# EAGLE schematic mainboard-01-8x2+1c (EAGLE 9.6.2)

## Sheet 1 of 17
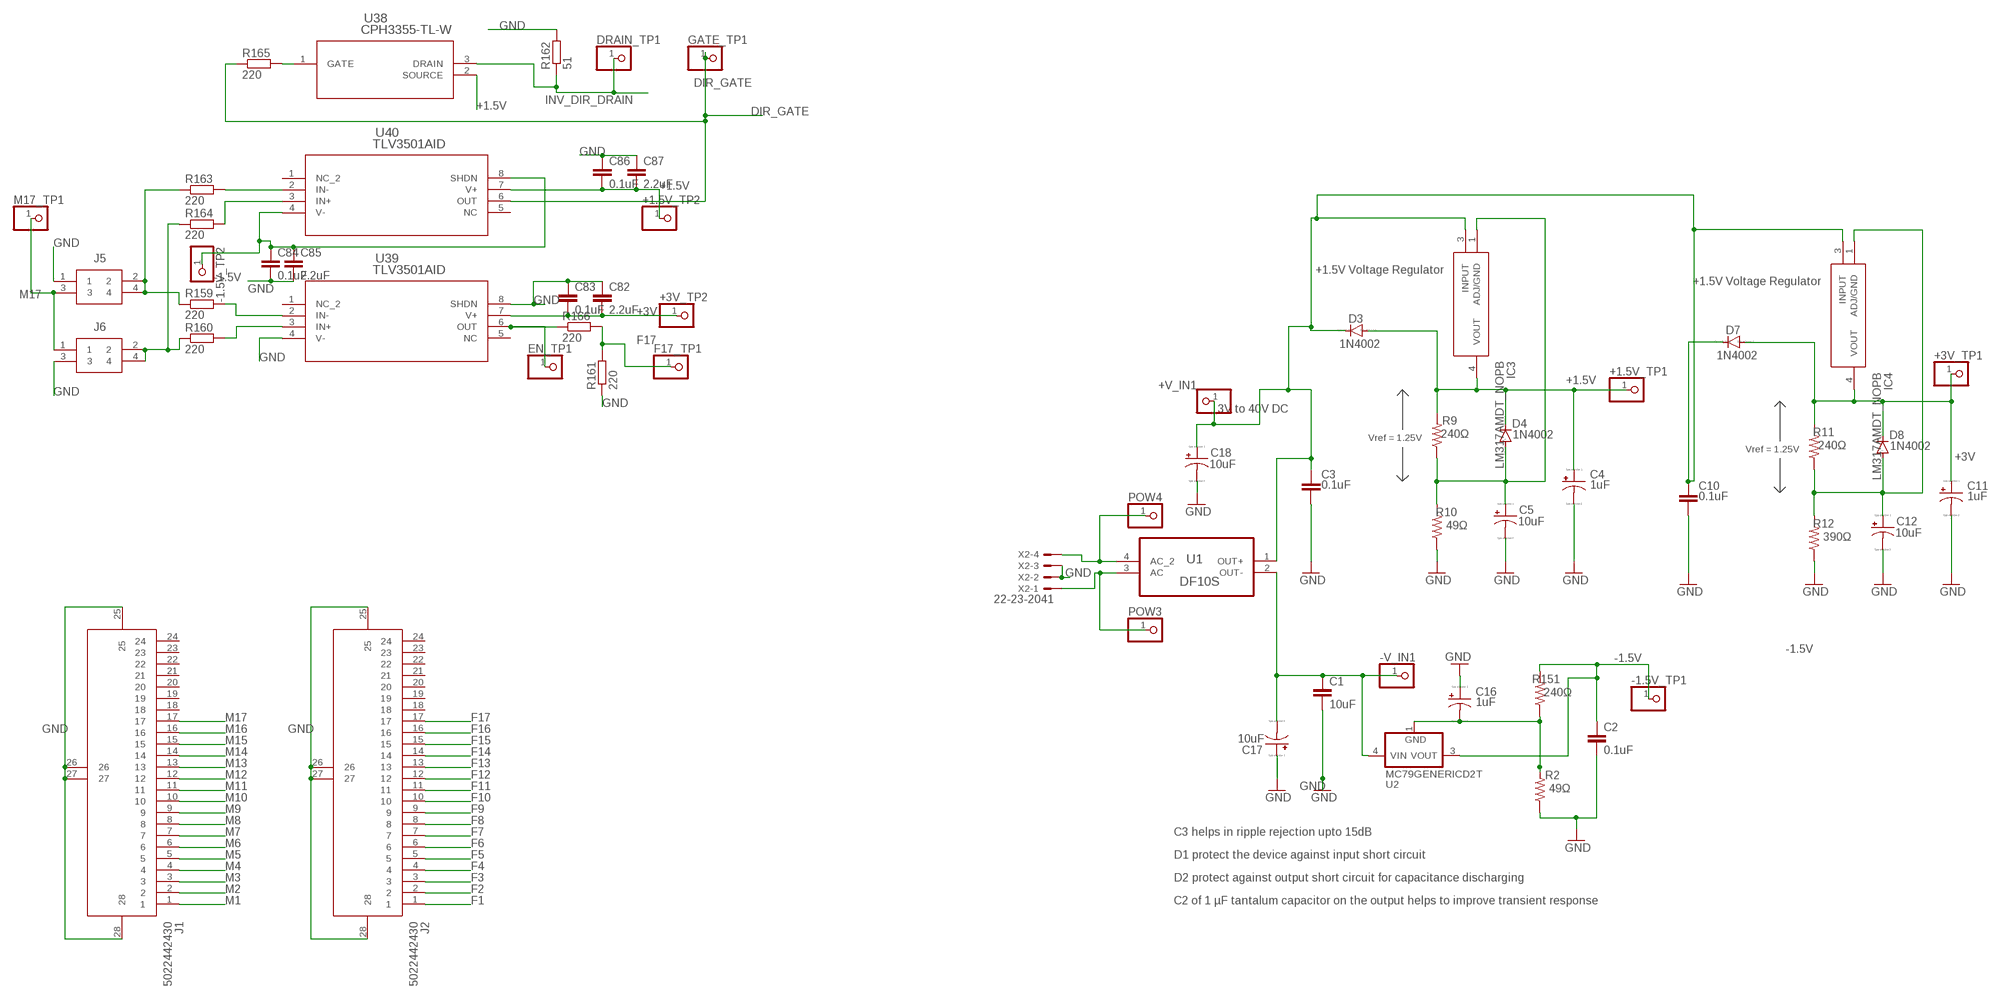
[diagram p0: schematic, sheet 1]

### Parts
+1.5V_TP1  PINHD-1X1  [1X01]
+1.5V_TP2  PINHD-1X1  [1X01]
+3V_TP1  PINHD-1X1  [1X01]
+3V_TP2  PINHD-1X1  [1X01]
+V_IN1  PINHD-1X1  [1X01]
-1.5V_TP1  PINHD-1X1  [1X01]
-1.5V_TP2  PINHD-1X1  [1X01]
-V_IN1  PINHD-1X1  [1X01]
C1  10uF  C-EUC0805  [C0805]
C2  0.1uF  C-EUC0805  [C0805]
C3  0.1uF  C-EU075-052X106  [C075-052X106]
C4  1uF  CPOL-US085CS-1AR  [085CS_1AR]
C5  10uF  CPOL-US085CS-1AR  [085CS_1AR]
C10  0.1uF  C-EU075-052X106  [C075-052X106]
C11  1uF  CPOL-US085CS-1AR  [085CS_1AR]
C12  10uF  CPOL-US085CS-1AR  [085CS_1AR]
C16  1uF  CPOL-US085CS-1AR  [085CS_1AR]
C17  10uF  CPOL-US085CS-1AR  [085CS_1AR]
C18  10uF  CPOL-US085CS-1AR  [085CS_1AR]
C82  2.2uF  C-EUC0805  [C0805]
C83  0.1uF  C-EUC0805  [C0805]
C84  0.1uF  C-EUC0805  [C0805]
C85  2.2uF  C-EUC0805  [C0805]
C86  0.1uF  C-EUC0805  [C0805]
C87  2.2uF  C-EUC0805  [C0805]
D3  1N4002  1N4004  [DO41-10]
D4  1N4002  1N4004  [DO41-10]
D7  1N4002  1N4004  [DO41-10]
D8  1N4002  1N4004  [DO41-10]
DRAIN_TP1  PINHD-1X1  [1X01]
EN_TP1  PINHD-1X1  [1X01]
F17_TP1  PINHD-1X1  [1X01]
GATE_TP1  PINHD-1X1  [1X01]
IC3  LM317AMDT_NOPB  [TO228P991X238-3N]
IC4  LM317AMDT_NOPB  [TO228P991X238-3N]
J1  5022442430  [5022442430]
J2  5022442430  [5022442430]
J5  70287-1098  [HDRV4W64P254_2X2_521X508X851P]
J6  70287-1098  [HDRV4W64P254_2X2_521X508X851P]
M17_TP1  PINHD-1X1  [1X01]
POW3  PINHD-1X1  [1X01]
POW4  PINHD-1X1  [1X01]
R2  49Ω  R-US_M0805  [M0805]
R9  240Ω  R-US_M0805  [M0805]
R10  49Ω  R-US_M0805  [M0805]
R11  240Ω  R-US_M0805  [M0805]
R12  390Ω  R-US_M0805  [M0805]
R151  240Ω  R-US_M0805  [M0805]
R159  220  R-EU_R0603  [R0603]
R160  220  R-EU_R0603  [R0603]
R161  220  R-EU_R0603  [R0603]
R162  51  R-EU_R0805  [R0805]
R163  220  R-EU_R0603  [R0603]
R164  220  R-EU_R0603  [R0603]
R165  220  R-EU_R0603  [R0603]
R166  220  R-EU_R0603  [R0603]
U1  DF10S  [SOT508P985X260-4N]
U2  MC79GENERICD2T  [D2PAK-3]
U38  CPH3355-TL-W  [CPH3_2P9X1P6_ONS]
U39  TLV3501AID  [D8]
U40  TLV3501AID  [D8]
X2  22-23-2041  [22-23-2041]

### Nets
+1.5V: +1.5V_TP1.1 +1.5V_TP2.1 C4.+ C86.2 C87.2 D3.A D4.C IC3.4(VOUT) R9.2 U38.2(SOURCE) U40.7(V+) ; also sheet 2,3,4,5,6,7,8,9,10,11,12,13,14,15,16,17
+3V: +3V_TP1.1 +3V_TP2.1 C11.+ C82.2 C83.2 D7.A D8.C IC4.4(VOUT) R11.2 U39.7(V+) ; also sheet 2,3,4,5,6,7,8,9,10,11,12,13,14,15,16,17
-1.5V: -1.5V_TP1.1 -1.5V_TP2.1 C2.1 C84.1 C85.1 R151.2 U2.3(VOUT) U40.4(V-) U40.8(SHDN) ; also sheet 2,3,4,5,6,7,8,9,10,11,12,13,14,15,16,17
DIR_GATE: GATE_TP1.1 R165.1 U40.6(OUT) ; also sheet 2,3,4,5,6,7,8,9,10,11,12,13,14,15,16,17
F1: J2.1 ; also sheet 17
F2: J2.2 ; also sheet 16
F3: J2.3 ; also sheet 15
F4: J2.4 ; also sheet 14
F5: J2.5 ; also sheet 13
F6: J2.6 ; also sheet 12
F7: J2.7 ; also sheet 11
F8: J2.8 ; also sheet 10
F9: J2.9 ; also sheet 9
F10: J2.10 ; also sheet 8
F11: J2.11 ; also sheet 7
F12: J2.12 ; also sheet 6
F13: J2.13 ; also sheet 5
F14: J2.14 ; also sheet 4
F15: J2.15 ; also sheet 3
F16: J2.16 ; also sheet 2
F17: F17_TP1.1 J2.17 R161.2 R166.2
GND: C1.2 C2.2 C3.2 C4.- C5.- C10.2 C11.- C12.- C16.+ C17.+ C18.- C82.1 C83.1 C84.2 C85.2 C86.1 C87.1 J1.25 J1.26 J1.27 J1.28 J2.25 J2.26 J2.27 J2.28 J5.1 J6.3 R2.1 R10.1 R12.1 R161.1 R162.2 U39.4(V-) U39.8(SHDN) X2.2 X2.3 ; also sheet 2,3,4,5,6,7,8,9,10,11,12,13,14,15,16,17
IN_2: POW3.1 U1.3(AC) X2.1
INPPOS1: +V_IN1.1 C3.1 C10.1 C18.+ D3.C D7.C IC3.3(INPUT) IC4.3(INPUT) U1.1(OUT+)
INV_DIR_DRAIN: DRAIN_TP1.1 R162.1 U38.3(DRAIN) ; also sheet 2,3,4,5,6,7,8,9,10,11,12,13,14,15,16,17
M1: J1.1 ; also sheet 17
M2: J1.2 ; also sheet 16
M3: J1.3 ; also sheet 15
M4: J1.4 ; also sheet 14
M5: J1.5 ; also sheet 13
M6: J1.6 ; also sheet 12
M7: J1.7 ; also sheet 11
M8: J1.8 ; also sheet 10
M9: J1.9 ; also sheet 9
M10: J1.10 ; also sheet 8
M11: J1.11 ; also sheet 7
M12: J1.12 ; also sheet 6
M13: J1.13 ; also sheet 5
M14: J1.14 ; also sheet 4
M15: J1.15 ; also sheet 3
M16: J1.16 ; also sheet 2
M17: J1.17 J5.3 J6.1 M17_TP1.1
N$2: C16.- R2.2 R151.1 U2.1(GND)
N$7: C5.+ D4.A IC3.1(ADJ/GND) R9.1 R10.2
N$8: C12.+ D8.A IC4.1(ADJ/GND) R11.1 R12.2
N$9: POW4.1 U1.4(AC_2) X2.4
N$10: -V_IN1.1 C1.1 C17.- U1.2(OUT-) U2.4(VIN)
N$158: R159.2 U39.2(IN-)
N$159: R160.2 U39.3(IN+)
N$160: EN_TP1.1 R166.1 U39.6(OUT)
N$161: J6.2 J6.4 R160.1 R164.1
N$162: J5.2 J5.4 R159.1 R163.1
N$163: R163.2 U40.2(IN-)
N$164: R164.2 U40.3(IN+)
N$165: R165.2 U38.1(GATE)
Unconnected: J1.18 J1.19 J1.20 J1.21 J1.22 J1.23 J1.24 J2.18 J2.19 J2.20 J2.21 J2.22 J2.23 J2.24 U39.1(NC_2) U39.5(NC) U40.1(NC_2) U40.5(NC)

### Notes on the sheet
- +1.5V Voltage Regulator
- +1.5V Voltage Regulator
- 3V to 40V DC
- Vref = 1.25V
- Vref = 1.25V
- C3 helps in ripple rejection upto 15dB
- D1 protect the device against input short circuit
- D2 protect against output short circuit for capacitance discharging
- C2 of 1 µF tantalum capacitor on the output helps to improve transient response

## Sheet 2 of 17
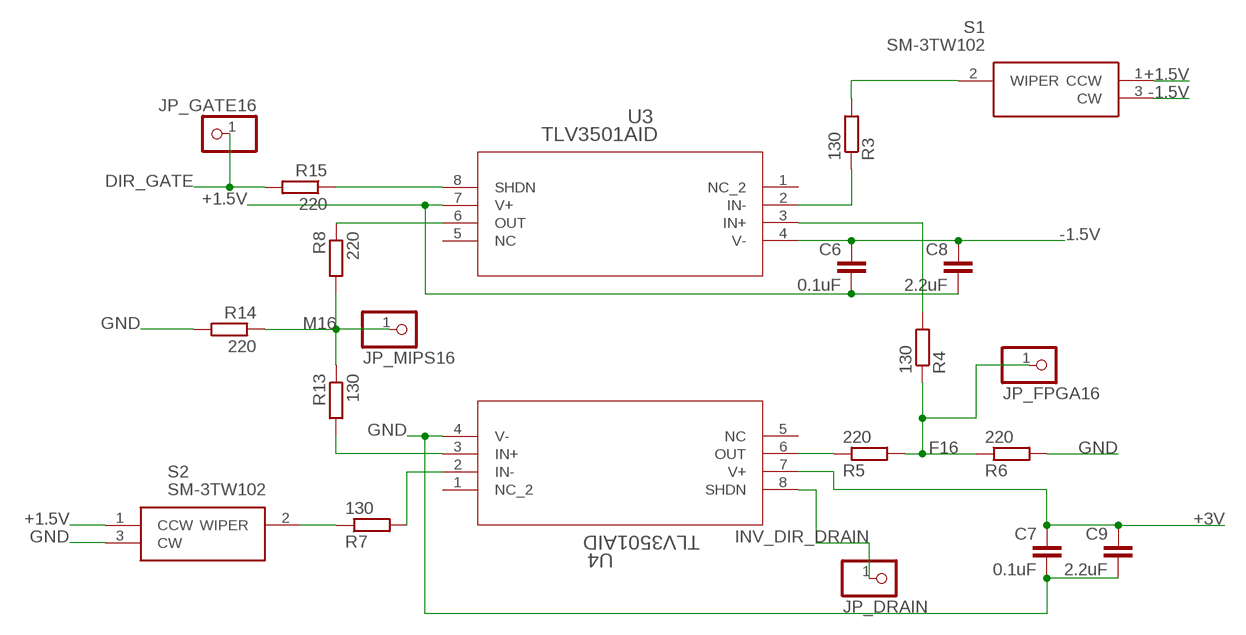
[diagram p1: schematic, sheet 2]

### Parts
C6  0.1uF  C-EUC0805  [C0805]
C7  0.1uF  C-EUC0805  [C0805]
C8  2.2uF  C-EUC0805  [C0805]
C9  2.2uF  C-EUC0805  [C0805]
JP_DRAIN  PINHD-1X1  [1X01]
JP_FPGA16  PINHD-1X1  [1X01]
JP_GATE16  PINHD-1X1  [1X01]
JP_MIPS16  PINHD-1X1  [1X01]
R3  130  R-EU_R0805  [R0805]
R4  130  R-EU_R0603  [R0603]
R5  220  R-EU_R0805  [R0805]
R6  220  R-EU_R0805  [R0805]
R7  130  R-EU_R0805  [R0805]
R8  220  R-EU_R0805  [R0805]
R13  130  R-EU_R0805  [R0805]
R14  220  R-EU_R0805  [R0805]
R15  220  R-EU_R0805  [R0805]
S1  SM-3TW102  [SM3TW102]
S2  SM-3TW102  [SM3TW102]
U3  TLV3501AID  [D8]
U4  TLV3501AID  [D8]

### Nets
+1.5V: C6.2 C8.2 S1.1(CCW) S2.1(CCW) U3.7(V+) ; also sheet 1,3,4,5,6,7,8,9,10,11,12,13,14,15,16,17
+3V: C7.1 C9.1 U4.7(V+) ; also sheet 1,3,4,5,6,7,8,9,10,11,12,13,14,15,16,17
-1.5V: C6.1 C8.1 S1.3(CW) U3.4(V-) ; also sheet 1,3,4,5,6,7,8,9,10,11,12,13,14,15,16,17
DIR_GATE: JP_GATE16.1 R15.2 ; also sheet 1,3,4,5,6,7,8,9,10,11,12,13,14,15,16,17
F16: JP_FPGA16.1 R4.1 R5.2 R6.1 ; also sheet 1
GND: C7.2 C9.2 R6.2 R14.2 S2.3(CW) U4.4(V-) ; also sheet 1,3,4,5,6,7,8,9,10,11,12,13,14,15,16,17
INV_DIR_DRAIN: JP_DRAIN.1 U4.8(SHDN) ; also sheet 1,3,4,5,6,7,8,9,10,11,12,13,14,15,16,17
M16: JP_MIPS16.1 R8.2 R13.1 R14.1 ; also sheet 1
N$1: R3.2 S1.2(WIPER)
N$3: R3.1 U3.2(IN-)
N$4: R4.2 U3.3(IN+)
N$5: R5.1 U4.6(OUT)
N$6: R7.1 S2.2(WIPER)
N$11: R7.2 U4.2(IN-)
N$12: R13.2 U4.3(IN+)
N$13: R8.1 U3.6(OUT)
N$14: R15.1 U3.8(SHDN)
Unconnected: U3.1(NC_2) U3.5(NC) U4.1(NC_2) U4.5(NC)

## Sheet 3 of 17
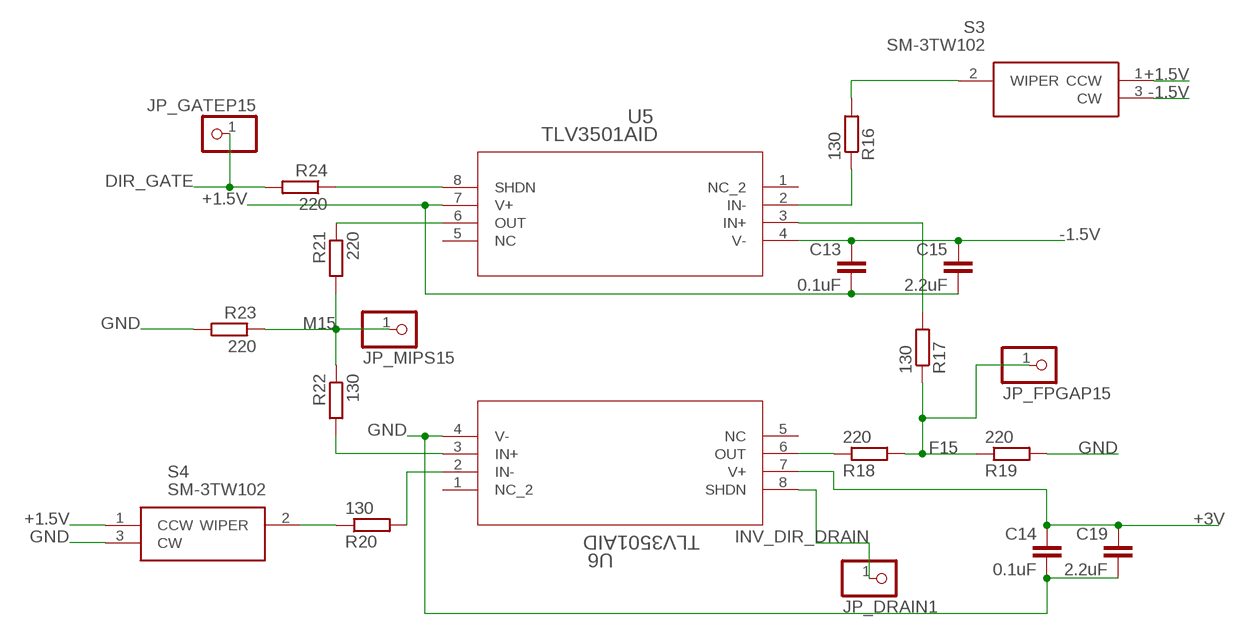
[diagram p2: schematic, sheet 3]

### Parts
C13  0.1uF  C-EUC0805  [C0805]
C14  0.1uF  C-EUC0805  [C0805]
C15  2.2uF  C-EUC0805  [C0805]
C19  2.2uF  C-EUC0805  [C0805]
JP_DRAIN1  PINHD-1X1  [1X01]
JP_FPGAP15  PINHD-1X1  [1X01]
JP_GATEP15  PINHD-1X1  [1X01]
JP_MIPS15  PINHD-1X1  [1X01]
R16  130  R-EU_R0805  [R0805]
R17  130  R-EU_R0603  [R0603]
R18  220  R-EU_R0805  [R0805]
R19  220  R-EU_R0805  [R0805]
R20  130  R-EU_R0805  [R0805]
R21  220  R-EU_R0805  [R0805]
R22  130  R-EU_R0805  [R0805]
R23  220  R-EU_R0805  [R0805]
R24  220  R-EU_R0805  [R0805]
S3  SM-3TW102  [SM3TW102]
S4  SM-3TW102  [SM3TW102]
U5  TLV3501AID  [D8]
U6  TLV3501AID  [D8]

### Nets
+1.5V: C13.2 C15.2 S3.1(CCW) S4.1(CCW) U5.7(V+) ; also sheet 1,2,4,5,6,7,8,9,10,11,12,13,14,15,16,17
+3V: C14.1 C19.1 U6.7(V+) ; also sheet 1,2,4,5,6,7,8,9,10,11,12,13,14,15,16,17
-1.5V: C13.1 C15.1 S3.3(CW) U5.4(V-) ; also sheet 1,2,4,5,6,7,8,9,10,11,12,13,14,15,16,17
DIR_GATE: JP_GATEP15.1 R24.2 ; also sheet 1,2,4,5,6,7,8,9,10,11,12,13,14,15,16,17
F15: JP_FPGAP15.1 R17.1 R18.2 R19.1 ; also sheet 1
GND: C14.2 C19.2 R19.2 R23.2 S4.3(CW) U6.4(V-) ; also sheet 1,2,4,5,6,7,8,9,10,11,12,13,14,15,16,17
INV_DIR_DRAIN: JP_DRAIN1.1 U6.8(SHDN) ; also sheet 1,2,4,5,6,7,8,9,10,11,12,13,14,15,16,17
M15: JP_MIPS15.1 R21.2 R22.1 R23.1 ; also sheet 1
N$15: R16.2 S3.2(WIPER)
N$16: R16.1 U5.2(IN-)
N$17: R17.2 U5.3(IN+)
N$18: R18.1 U6.6(OUT)
N$19: R20.1 S4.2(WIPER)
N$20: R20.2 U6.2(IN-)
N$21: R22.2 U6.3(IN+)
N$22: R21.1 U5.6(OUT)
N$23: R24.1 U5.8(SHDN)
Unconnected: U5.1(NC_2) U5.5(NC) U6.1(NC_2) U6.5(NC)

## Sheet 4 of 17
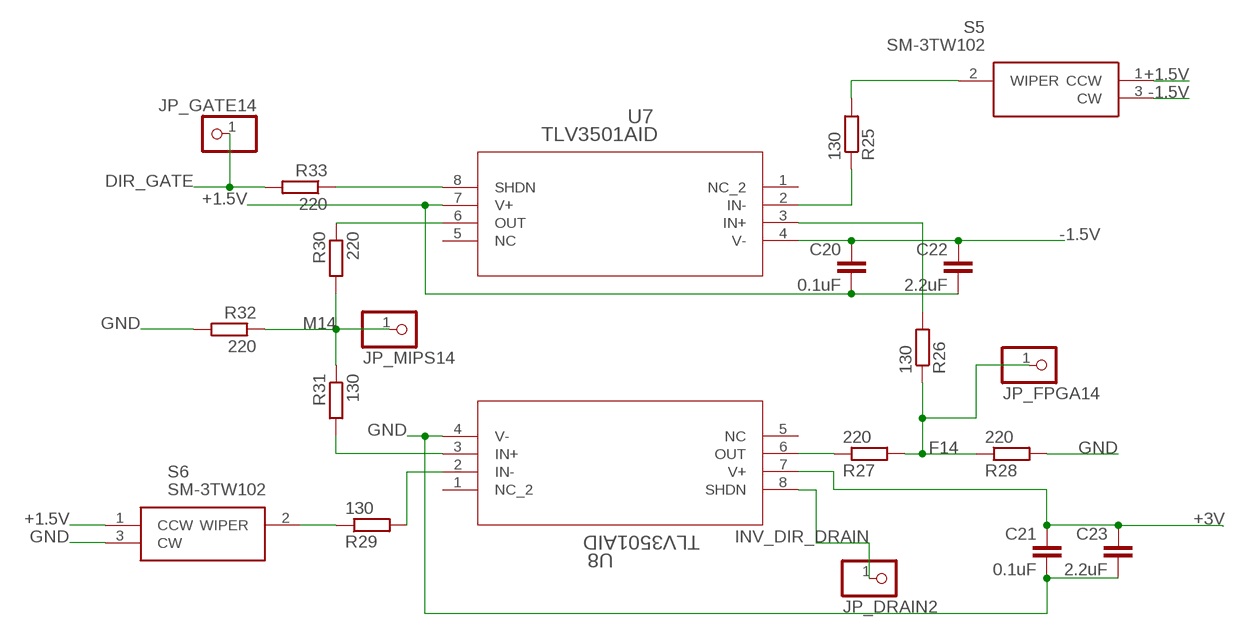
[diagram p3: schematic, sheet 4]

### Parts
C20  0.1uF  C-EUC0805  [C0805]
C21  0.1uF  C-EUC0805  [C0805]
C22  2.2uF  C-EUC0805  [C0805]
C23  2.2uF  C-EUC0805  [C0805]
JP_DRAIN2  PINHD-1X1  [1X01]
JP_FPGA14  PINHD-1X1  [1X01]
JP_GATE14  PINHD-1X1  [1X01]
JP_MIPS14  PINHD-1X1  [1X01]
R25  130  R-EU_R0805  [R0805]
R26  130  R-EU_R0603  [R0603]
R27  220  R-EU_R0805  [R0805]
R28  220  R-EU_R0805  [R0805]
R29  130  R-EU_R0805  [R0805]
R30  220  R-EU_R0805  [R0805]
R31  130  R-EU_R0805  [R0805]
R32  220  R-EU_R0805  [R0805]
R33  220  R-EU_R0805  [R0805]
S5  SM-3TW102  [SM3TW102]
S6  SM-3TW102  [SM3TW102]
U7  TLV3501AID  [D8]
U8  TLV3501AID  [D8]

### Nets
+1.5V: C20.2 C22.2 S5.1(CCW) S6.1(CCW) U7.7(V+) ; also sheet 1,2,3,5,6,7,8,9,10,11,12,13,14,15,16,17
+3V: C21.1 C23.1 U8.7(V+) ; also sheet 1,2,3,5,6,7,8,9,10,11,12,13,14,15,16,17
-1.5V: C20.1 C22.1 S5.3(CW) U7.4(V-) ; also sheet 1,2,3,5,6,7,8,9,10,11,12,13,14,15,16,17
DIR_GATE: JP_GATE14.1 R33.2 ; also sheet 1,2,3,5,6,7,8,9,10,11,12,13,14,15,16,17
F14: JP_FPGA14.1 R26.1 R27.2 R28.1 ; also sheet 1
GND: C21.2 C23.2 R28.2 R32.2 S6.3(CW) U8.4(V-) ; also sheet 1,2,3,5,6,7,8,9,10,11,12,13,14,15,16,17
INV_DIR_DRAIN: JP_DRAIN2.1 U8.8(SHDN) ; also sheet 1,2,3,5,6,7,8,9,10,11,12,13,14,15,16,17
M14: JP_MIPS14.1 R30.2 R31.1 R32.1 ; also sheet 1
N$24: R25.2 S5.2(WIPER)
N$25: R25.1 U7.2(IN-)
N$26: R26.2 U7.3(IN+)
N$27: R27.1 U8.6(OUT)
N$28: R29.1 S6.2(WIPER)
N$29: R29.2 U8.2(IN-)
N$30: R31.2 U8.3(IN+)
N$31: R30.1 U7.6(OUT)
N$32: R33.1 U7.8(SHDN)
Unconnected: U7.1(NC_2) U7.5(NC) U8.1(NC_2) U8.5(NC)

## Sheet 5 of 17
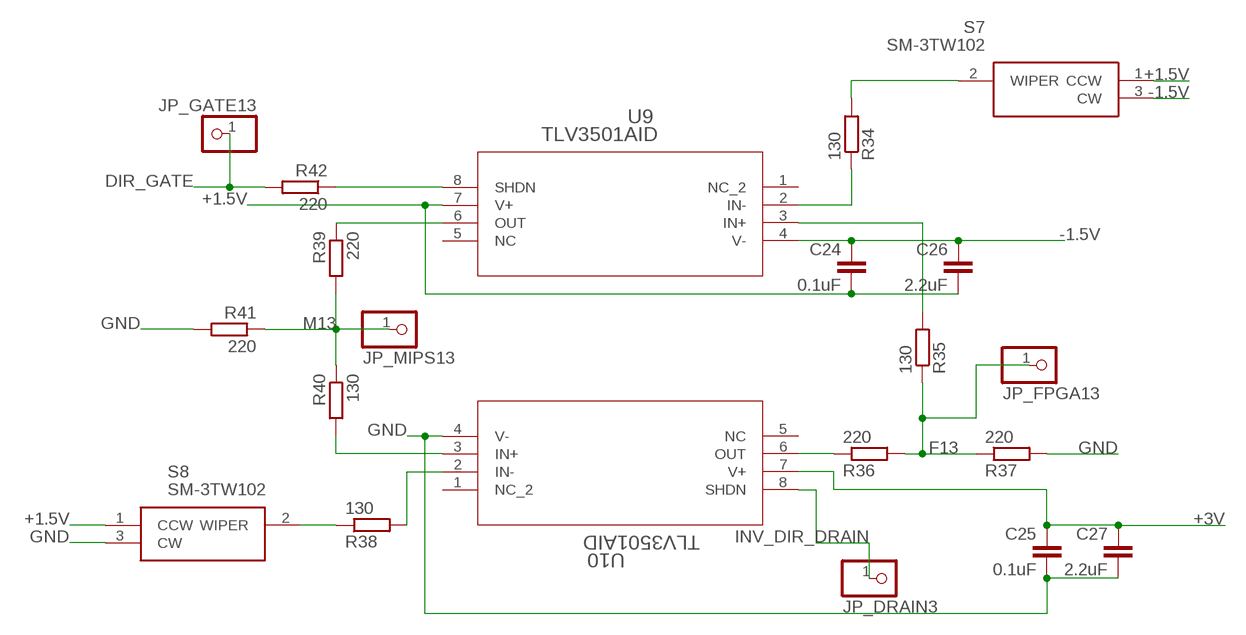
[diagram p4: schematic, sheet 5]

### Parts
C24  0.1uF  C-EUC0805  [C0805]
C25  0.1uF  C-EUC0805  [C0805]
C26  2.2uF  C-EUC0805  [C0805]
C27  2.2uF  C-EUC0805  [C0805]
JP_DRAIN3  PINHD-1X1  [1X01]
JP_FPGA13  PINHD-1X1  [1X01]
JP_GATE13  PINHD-1X1  [1X01]
JP_MIPS13  PINHD-1X1  [1X01]
R34  130  R-EU_R0805  [R0805]
R35  130  R-EU_R0603  [R0603]
R36  220  R-EU_R0805  [R0805]
R37  220  R-EU_R0805  [R0805]
R38  130  R-EU_R0805  [R0805]
R39  220  R-EU_R0805  [R0805]
R40  130  R-EU_R0805  [R0805]
R41  220  R-EU_R0805  [R0805]
R42  220  R-EU_R0805  [R0805]
S7  SM-3TW102  [SM3TW102]
S8  SM-3TW102  [SM3TW102]
U9  TLV3501AID  [D8]
U10  TLV3501AID  [D8]

### Nets
+1.5V: C24.2 C26.2 S7.1(CCW) S8.1(CCW) U9.7(V+) ; also sheet 1,2,3,4,6,7,8,9,10,11,12,13,14,15,16,17
+3V: C25.1 C27.1 U10.7(V+) ; also sheet 1,2,3,4,6,7,8,9,10,11,12,13,14,15,16,17
-1.5V: C24.1 C26.1 S7.3(CW) U9.4(V-) ; also sheet 1,2,3,4,6,7,8,9,10,11,12,13,14,15,16,17
DIR_GATE: JP_GATE13.1 R42.2 ; also sheet 1,2,3,4,6,7,8,9,10,11,12,13,14,15,16,17
F13: JP_FPGA13.1 R35.1 R36.2 R37.1 ; also sheet 1
GND: C25.2 C27.2 R37.2 R41.2 S8.3(CW) U10.4(V-) ; also sheet 1,2,3,4,6,7,8,9,10,11,12,13,14,15,16,17
INV_DIR_DRAIN: JP_DRAIN3.1 U10.8(SHDN) ; also sheet 1,2,3,4,6,7,8,9,10,11,12,13,14,15,16,17
M13: JP_MIPS13.1 R39.2 R40.1 R41.1 ; also sheet 1
N$33: R34.2 S7.2(WIPER)
N$34: R34.1 U9.2(IN-)
N$35: R35.2 U9.3(IN+)
N$36: R36.1 U10.6(OUT)
N$37: R38.1 S8.2(WIPER)
N$38: R38.2 U10.2(IN-)
N$39: R40.2 U10.3(IN+)
N$40: R39.1 U9.6(OUT)
N$41: R42.1 U9.8(SHDN)
Unconnected: U9.1(NC_2) U9.5(NC) U10.1(NC_2) U10.5(NC)

## Sheet 6 of 17
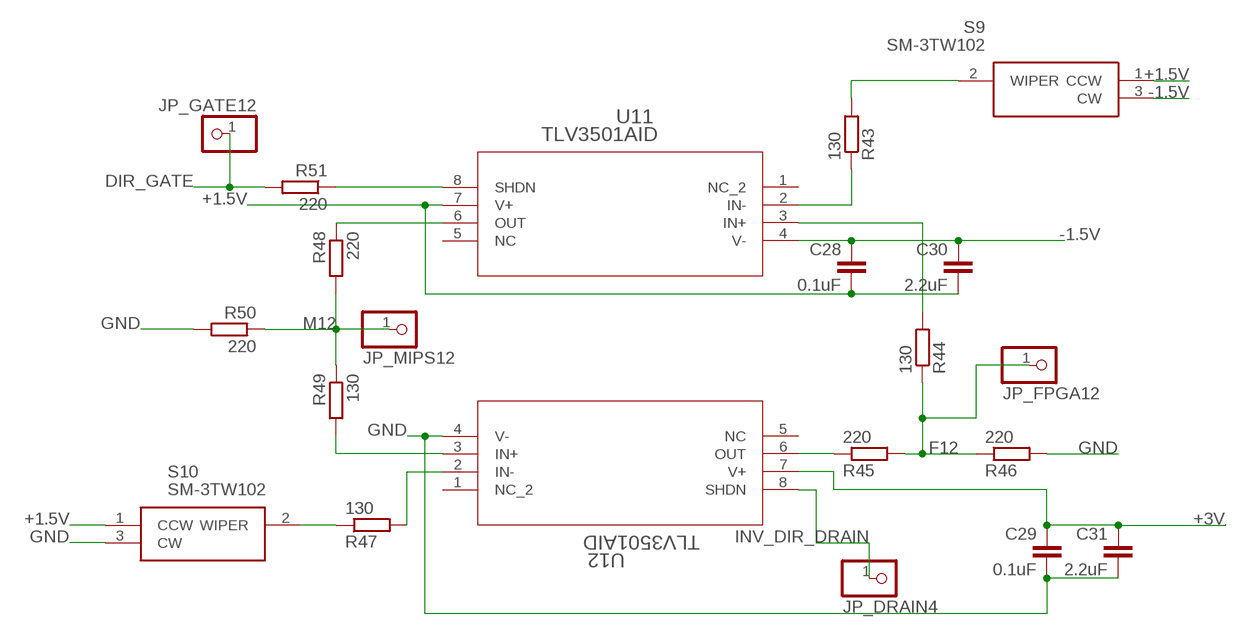
[diagram p5: schematic, sheet 6]

### Parts
C28  0.1uF  C-EUC0805  [C0805]
C29  0.1uF  C-EUC0805  [C0805]
C30  2.2uF  C-EUC0805  [C0805]
C31  2.2uF  C-EUC0805  [C0805]
JP_DRAIN4  PINHD-1X1  [1X01]
JP_FPGA12  PINHD-1X1  [1X01]
JP_GATE12  PINHD-1X1  [1X01]
JP_MIPS12  PINHD-1X1  [1X01]
R43  130  R-EU_R0805  [R0805]
R44  130  R-EU_R0603  [R0603]
R45  220  R-EU_R0805  [R0805]
R46  220  R-EU_R0805  [R0805]
R47  130  R-EU_R0805  [R0805]
R48  220  R-EU_R0805  [R0805]
R49  130  R-EU_R0805  [R0805]
R50  220  R-EU_R0805  [R0805]
R51  220  R-EU_R0805  [R0805]
S9  SM-3TW102  [SM3TW102]
S10  SM-3TW102  [SM3TW102]
U11  TLV3501AID  [D8]
U12  TLV3501AID  [D8]

### Nets
+1.5V: C28.2 C30.2 S9.1(CCW) S10.1(CCW) U11.7(V+) ; also sheet 1,2,3,4,5,7,8,9,10,11,12,13,14,15,16,17
+3V: C29.1 C31.1 U12.7(V+) ; also sheet 1,2,3,4,5,7,8,9,10,11,12,13,14,15,16,17
-1.5V: C28.1 C30.1 S9.3(CW) U11.4(V-) ; also sheet 1,2,3,4,5,7,8,9,10,11,12,13,14,15,16,17
DIR_GATE: JP_GATE12.1 R51.2 ; also sheet 1,2,3,4,5,7,8,9,10,11,12,13,14,15,16,17
F12: JP_FPGA12.1 R44.1 R45.2 R46.1 ; also sheet 1
GND: C29.2 C31.2 R46.2 R50.2 S10.3(CW) U12.4(V-) ; also sheet 1,2,3,4,5,7,8,9,10,11,12,13,14,15,16,17
INV_DIR_DRAIN: JP_DRAIN4.1 U12.8(SHDN) ; also sheet 1,2,3,4,5,7,8,9,10,11,12,13,14,15,16,17
M12: JP_MIPS12.1 R48.2 R49.1 R50.1 ; also sheet 1
N$42: R43.2 S9.2(WIPER)
N$43: R43.1 U11.2(IN-)
N$44: R44.2 U11.3(IN+)
N$45: R45.1 U12.6(OUT)
N$46: R47.1 S10.2(WIPER)
N$47: R47.2 U12.2(IN-)
N$48: R49.2 U12.3(IN+)
N$49: R48.1 U11.6(OUT)
N$50: R51.1 U11.8(SHDN)
Unconnected: U11.1(NC_2) U11.5(NC) U12.1(NC_2) U12.5(NC)

## Sheet 7 of 17
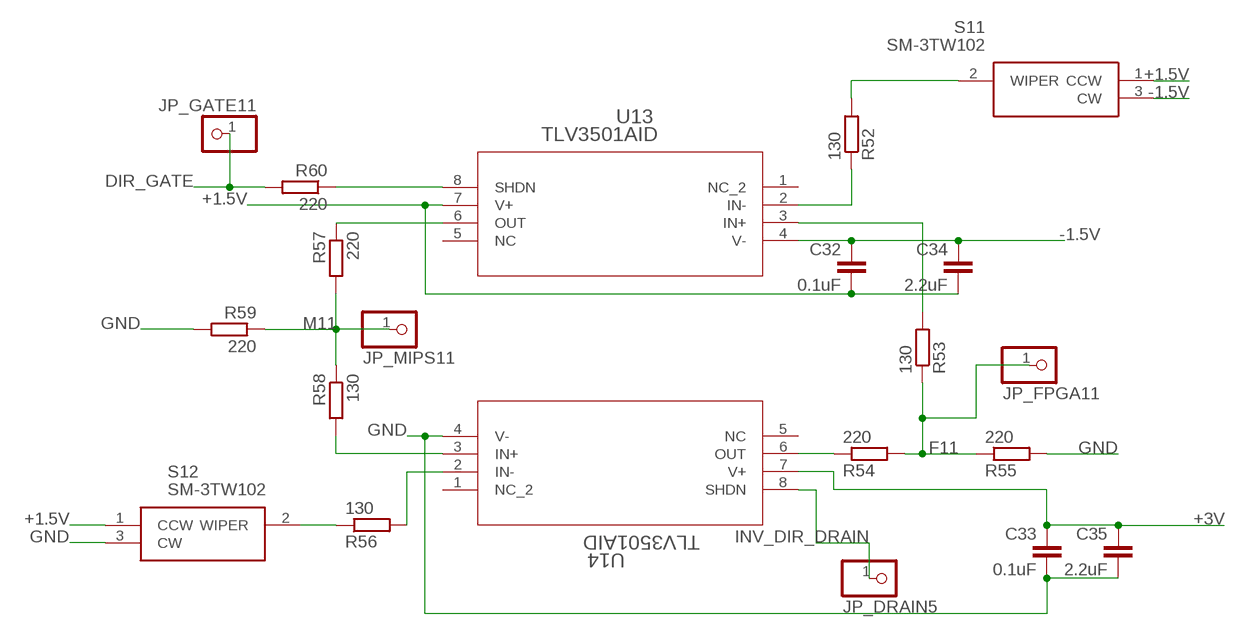
[diagram p6: schematic, sheet 7]

### Parts
C32  0.1uF  C-EUC0805  [C0805]
C33  0.1uF  C-EUC0805  [C0805]
C34  2.2uF  C-EUC0805  [C0805]
C35  2.2uF  C-EUC0805  [C0805]
JP_DRAIN5  PINHD-1X1  [1X01]
JP_FPGA11  PINHD-1X1  [1X01]
JP_GATE11  PINHD-1X1  [1X01]
JP_MIPS11  PINHD-1X1  [1X01]
R52  130  R-EU_R0805  [R0805]
R53  130  R-EU_R0603  [R0603]
R54  220  R-EU_R0805  [R0805]
R55  220  R-EU_R0805  [R0805]
R56  130  R-EU_R0805  [R0805]
R57  220  R-EU_R0805  [R0805]
R58  130  R-EU_R0805  [R0805]
R59  220  R-EU_R0805  [R0805]
R60  220  R-EU_R0805  [R0805]
S11  SM-3TW102  [SM3TW102]
S12  SM-3TW102  [SM3TW102]
U13  TLV3501AID  [D8]
U14  TLV3501AID  [D8]

### Nets
+1.5V: C32.2 C34.2 S11.1(CCW) S12.1(CCW) U13.7(V+) ; also sheet 1,2,3,4,5,6,8,9,10,11,12,13,14,15,16,17
+3V: C33.1 C35.1 U14.7(V+) ; also sheet 1,2,3,4,5,6,8,9,10,11,12,13,14,15,16,17
-1.5V: C32.1 C34.1 S11.3(CW) U13.4(V-) ; also sheet 1,2,3,4,5,6,8,9,10,11,12,13,14,15,16,17
DIR_GATE: JP_GATE11.1 R60.2 ; also sheet 1,2,3,4,5,6,8,9,10,11,12,13,14,15,16,17
F11: JP_FPGA11.1 R53.1 R54.2 R55.1 ; also sheet 1
GND: C33.2 C35.2 R55.2 R59.2 S12.3(CW) U14.4(V-) ; also sheet 1,2,3,4,5,6,8,9,10,11,12,13,14,15,16,17
INV_DIR_DRAIN: JP_DRAIN5.1 U14.8(SHDN) ; also sheet 1,2,3,4,5,6,8,9,10,11,12,13,14,15,16,17
M11: JP_MIPS11.1 R57.2 R58.1 R59.1 ; also sheet 1
N$51: R52.2 S11.2(WIPER)
N$52: R52.1 U13.2(IN-)
N$53: R53.2 U13.3(IN+)
N$54: R54.1 U14.6(OUT)
N$55: R56.1 S12.2(WIPER)
N$56: R56.2 U14.2(IN-)
N$57: R58.2 U14.3(IN+)
N$58: R57.1 U13.6(OUT)
N$59: R60.1 U13.8(SHDN)
Unconnected: U13.1(NC_2) U13.5(NC) U14.1(NC_2) U14.5(NC)

## Sheet 8 of 17
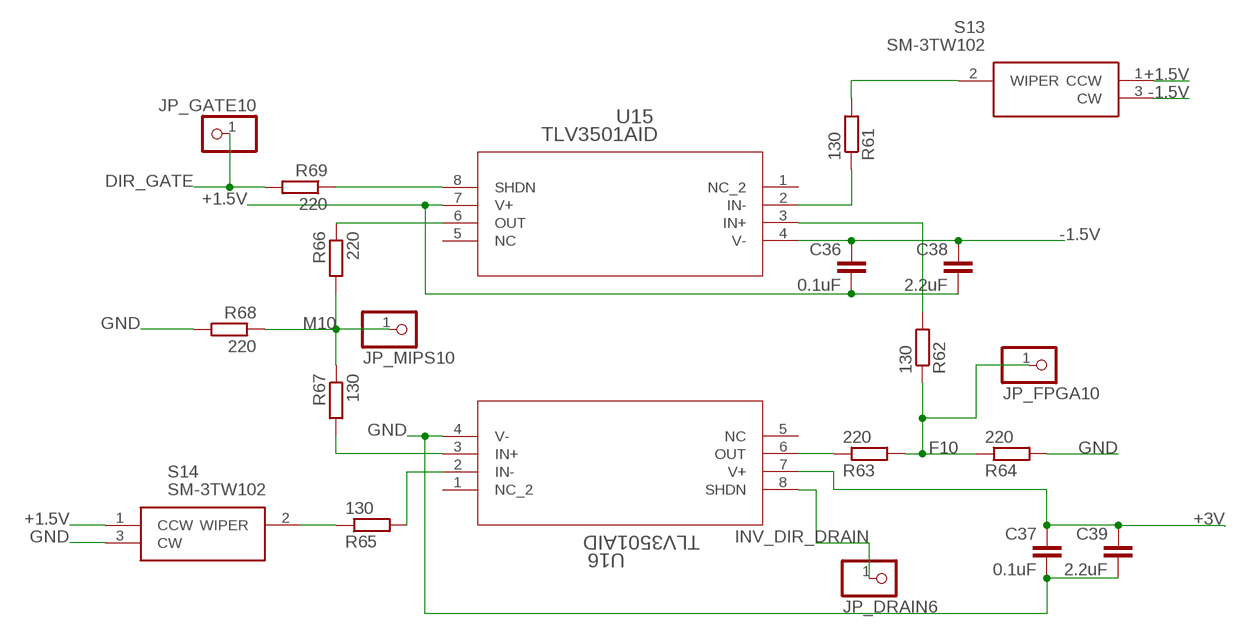
[diagram p7: schematic, sheet 8]

### Parts
C36  0.1uF  C-EUC0805  [C0805]
C37  0.1uF  C-EUC0805  [C0805]
C38  2.2uF  C-EUC0805  [C0805]
C39  2.2uF  C-EUC0805  [C0805]
JP_DRAIN6  PINHD-1X1  [1X01]
JP_FPGA10  PINHD-1X1  [1X01]
JP_GATE10  PINHD-1X1  [1X01]
JP_MIPS10  PINHD-1X1  [1X01]
R61  130  R-EU_R0805  [R0805]
R62  130  R-EU_R0603  [R0603]
R63  220  R-EU_R0805  [R0805]
R64  220  R-EU_R0805  [R0805]
R65  130  R-EU_R0805  [R0805]
R66  220  R-EU_R0805  [R0805]
R67  130  R-EU_R0805  [R0805]
R68  220  R-EU_R0805  [R0805]
R69  220  R-EU_R0805  [R0805]
S13  SM-3TW102  [SM3TW102]
S14  SM-3TW102  [SM3TW102]
U15  TLV3501AID  [D8]
U16  TLV3501AID  [D8]

### Nets
+1.5V: C36.2 C38.2 S13.1(CCW) S14.1(CCW) U15.7(V+) ; also sheet 1,2,3,4,5,6,7,9,10,11,12,13,14,15,16,17
+3V: C37.1 C39.1 U16.7(V+) ; also sheet 1,2,3,4,5,6,7,9,10,11,12,13,14,15,16,17
-1.5V: C36.1 C38.1 S13.3(CW) U15.4(V-) ; also sheet 1,2,3,4,5,6,7,9,10,11,12,13,14,15,16,17
DIR_GATE: JP_GATE10.1 R69.2 ; also sheet 1,2,3,4,5,6,7,9,10,11,12,13,14,15,16,17
F10: JP_FPGA10.1 R62.1 R63.2 R64.1 ; also sheet 1
GND: C37.2 C39.2 R64.2 R68.2 S14.3(CW) U16.4(V-) ; also sheet 1,2,3,4,5,6,7,9,10,11,12,13,14,15,16,17
INV_DIR_DRAIN: JP_DRAIN6.1 U16.8(SHDN) ; also sheet 1,2,3,4,5,6,7,9,10,11,12,13,14,15,16,17
M10: JP_MIPS10.1 R66.2 R67.1 R68.1 ; also sheet 1
N$60: R61.2 S13.2(WIPER)
N$61: R61.1 U15.2(IN-)
N$62: R62.2 U15.3(IN+)
N$63: R63.1 U16.6(OUT)
N$64: R65.1 S14.2(WIPER)
N$65: R65.2 U16.2(IN-)
N$66: R67.2 U16.3(IN+)
N$67: R66.1 U15.6(OUT)
N$68: R69.1 U15.8(SHDN)
Unconnected: U15.1(NC_2) U15.5(NC) U16.1(NC_2) U16.5(NC)

## Sheet 9 of 17
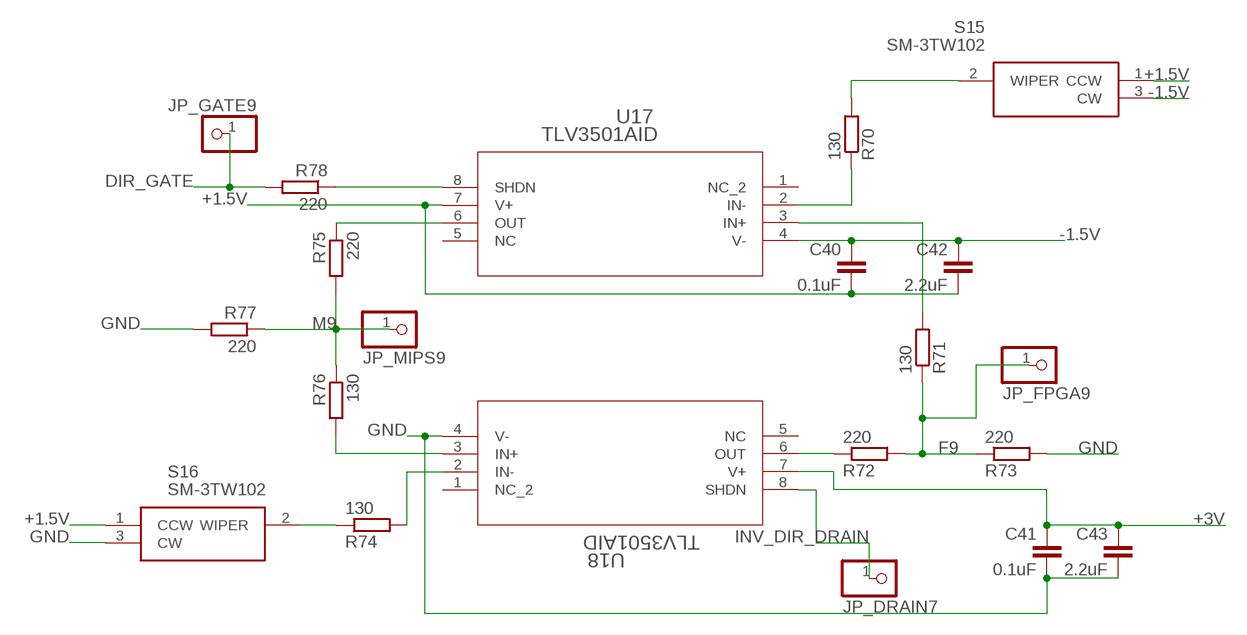
[diagram p8: schematic, sheet 9]

### Parts
C40  0.1uF  C-EUC0805  [C0805]
C41  0.1uF  C-EUC0805  [C0805]
C42  2.2uF  C-EUC0805  [C0805]
C43  2.2uF  C-EUC0805  [C0805]
JP_DRAIN7  PINHD-1X1  [1X01]
JP_FPGA9  PINHD-1X1  [1X01]
JP_GATE9  PINHD-1X1  [1X01]
JP_MIPS9  PINHD-1X1  [1X01]
R70  130  R-EU_R0805  [R0805]
R71  130  R-EU_R0603  [R0603]
R72  220  R-EU_R0805  [R0805]
R73  220  R-EU_R0805  [R0805]
R74  130  R-EU_R0805  [R0805]
R75  220  R-EU_R0805  [R0805]
R76  130  R-EU_R0805  [R0805]
R77  220  R-EU_R0805  [R0805]
R78  220  R-EU_R0805  [R0805]
S15  SM-3TW102  [SM3TW102]
S16  SM-3TW102  [SM3TW102]
U17  TLV3501AID  [D8]
U18  TLV3501AID  [D8]

### Nets
+1.5V: C40.2 C42.2 S15.1(CCW) S16.1(CCW) U17.7(V+) ; also sheet 1,2,3,4,5,6,7,8,10,11,12,13,14,15,16,17
+3V: C41.1 C43.1 U18.7(V+) ; also sheet 1,2,3,4,5,6,7,8,10,11,12,13,14,15,16,17
-1.5V: C40.1 C42.1 S15.3(CW) U17.4(V-) ; also sheet 1,2,3,4,5,6,7,8,10,11,12,13,14,15,16,17
DIR_GATE: JP_GATE9.1 R78.2 ; also sheet 1,2,3,4,5,6,7,8,10,11,12,13,14,15,16,17
F9: JP_FPGA9.1 R71.1 R72.2 R73.1 ; also sheet 1
GND: C41.2 C43.2 R73.2 R77.2 S16.3(CW) U18.4(V-) ; also sheet 1,2,3,4,5,6,7,8,10,11,12,13,14,15,16,17
INV_DIR_DRAIN: JP_DRAIN7.1 U18.8(SHDN) ; also sheet 1,2,3,4,5,6,7,8,10,11,12,13,14,15,16,17
M9: JP_MIPS9.1 R75.2 R76.1 R77.1 ; also sheet 1
N$69: R70.2 S15.2(WIPER)
N$70: R70.1 U17.2(IN-)
N$71: R71.2 U17.3(IN+)
N$72: R72.1 U18.6(OUT)
N$73: R74.1 S16.2(WIPER)
N$74: R74.2 U18.2(IN-)
N$75: R76.2 U18.3(IN+)
N$76: R75.1 U17.6(OUT)
N$77: R78.1 U17.8(SHDN)
Unconnected: U17.1(NC_2) U17.5(NC) U18.1(NC_2) U18.5(NC)

## Sheet 10 of 17
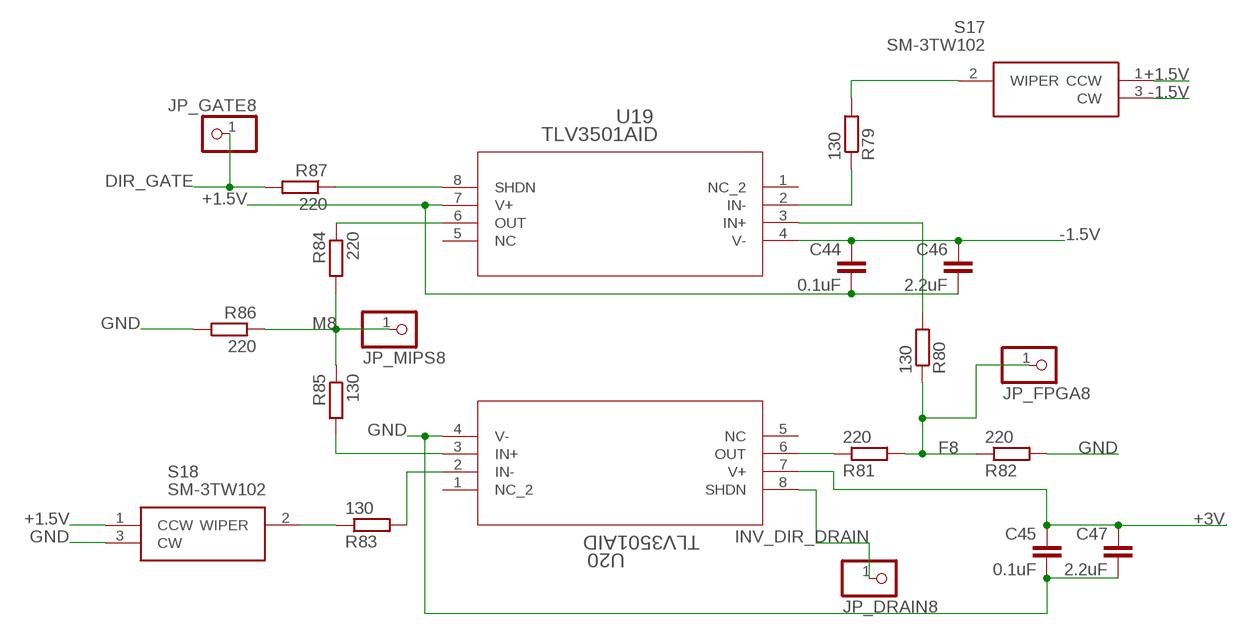
[diagram p9: schematic, sheet 10]

### Parts
C44  0.1uF  C-EUC0805  [C0805]
C45  0.1uF  C-EUC0805  [C0805]
C46  2.2uF  C-EUC0805  [C0805]
C47  2.2uF  C-EUC0805  [C0805]
JP_DRAIN8  PINHD-1X1  [1X01]
JP_FPGA8  PINHD-1X1  [1X01]
JP_GATE8  PINHD-1X1  [1X01]
JP_MIPS8  PINHD-1X1  [1X01]
R79  130  R-EU_R0805  [R0805]
R80  130  R-EU_R0603  [R0603]
R81  220  R-EU_R0805  [R0805]
R82  220  R-EU_R0805  [R0805]
R83  130  R-EU_R0805  [R0805]
R84  220  R-EU_R0805  [R0805]
R85  130  R-EU_R0805  [R0805]
R86  220  R-EU_R0805  [R0805]
R87  220  R-EU_R0805  [R0805]
S17  SM-3TW102  [SM3TW102]
S18  SM-3TW102  [SM3TW102]
U19  TLV3501AID  [D8]
U20  TLV3501AID  [D8]

### Nets
+1.5V: C44.2 C46.2 S17.1(CCW) S18.1(CCW) U19.7(V+) ; also sheet 1,2,3,4,5,6,7,8,9,11,12,13,14,15,16,17
+3V: C45.1 C47.1 U20.7(V+) ; also sheet 1,2,3,4,5,6,7,8,9,11,12,13,14,15,16,17
-1.5V: C44.1 C46.1 S17.3(CW) U19.4(V-) ; also sheet 1,2,3,4,5,6,7,8,9,11,12,13,14,15,16,17
DIR_GATE: JP_GATE8.1 R87.2 ; also sheet 1,2,3,4,5,6,7,8,9,11,12,13,14,15,16,17
F8: JP_FPGA8.1 R80.1 R81.2 R82.1 ; also sheet 1
GND: C45.2 C47.2 R82.2 R86.2 S18.3(CW) U20.4(V-) ; also sheet 1,2,3,4,5,6,7,8,9,11,12,13,14,15,16,17
INV_DIR_DRAIN: JP_DRAIN8.1 U20.8(SHDN) ; also sheet 1,2,3,4,5,6,7,8,9,11,12,13,14,15,16,17
M8: JP_MIPS8.1 R84.2 R85.1 R86.1 ; also sheet 1
N$78: R79.2 S17.2(WIPER)
N$79: R79.1 U19.2(IN-)
N$80: R80.2 U19.3(IN+)
N$81: R81.1 U20.6(OUT)
N$82: R83.1 S18.2(WIPER)
N$83: R83.2 U20.2(IN-)
N$84: R85.2 U20.3(IN+)
N$85: R84.1 U19.6(OUT)
N$86: R87.1 U19.8(SHDN)
Unconnected: U19.1(NC_2) U19.5(NC) U20.1(NC_2) U20.5(NC)

## Sheet 11 of 17
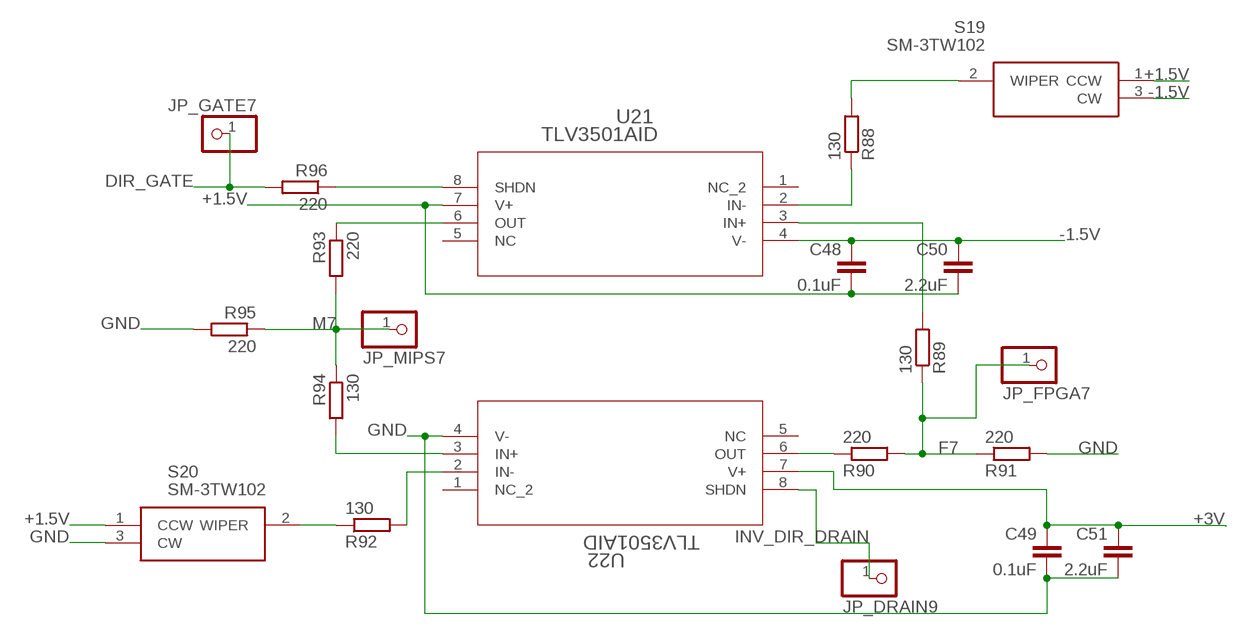
[diagram p10: schematic, sheet 11]

### Parts
C48  0.1uF  C-EUC0805  [C0805]
C49  0.1uF  C-EUC0805  [C0805]
C50  2.2uF  C-EUC0805  [C0805]
C51  2.2uF  C-EUC0805  [C0805]
JP_DRAIN9  PINHD-1X1  [1X01]
JP_FPGA7  PINHD-1X1  [1X01]
JP_GATE7  PINHD-1X1  [1X01]
JP_MIPS7  PINHD-1X1  [1X01]
R88  130  R-EU_R0805  [R0805]
R89  130  R-EU_R0603  [R0603]
R90  220  R-EU_R0805  [R0805]
R91  220  R-EU_R0805  [R0805]
R92  130  R-EU_R0805  [R0805]
R93  220  R-EU_R0805  [R0805]
R94  130  R-EU_R0805  [R0805]
R95  220  R-EU_R0805  [R0805]
R96  220  R-EU_R0805  [R0805]
S19  SM-3TW102  [SM3TW102]
S20  SM-3TW102  [SM3TW102]
U21  TLV3501AID  [D8]
U22  TLV3501AID  [D8]

### Nets
+1.5V: C48.2 C50.2 S19.1(CCW) S20.1(CCW) U21.7(V+) ; also sheet 1,2,3,4,5,6,7,8,9,10,12,13,14,15,16,17
+3V: C49.1 C51.1 U22.7(V+) ; also sheet 1,2,3,4,5,6,7,8,9,10,12,13,14,15,16,17
-1.5V: C48.1 C50.1 S19.3(CW) U21.4(V-) ; also sheet 1,2,3,4,5,6,7,8,9,10,12,13,14,15,16,17
DIR_GATE: JP_GATE7.1 R96.2 ; also sheet 1,2,3,4,5,6,7,8,9,10,12,13,14,15,16,17
F7: JP_FPGA7.1 R89.1 R90.2 R91.1 ; also sheet 1
GND: C49.2 C51.2 R91.2 R95.2 S20.3(CW) U22.4(V-) ; also sheet 1,2,3,4,5,6,7,8,9,10,12,13,14,15,16,17
INV_DIR_DRAIN: JP_DRAIN9.1 U22.8(SHDN) ; also sheet 1,2,3,4,5,6,7,8,9,10,12,13,14,15,16,17
M7: JP_MIPS7.1 R93.2 R94.1 R95.1 ; also sheet 1
N$87: R88.2 S19.2(WIPER)
N$88: R88.1 U21.2(IN-)
N$89: R89.2 U21.3(IN+)
N$90: R90.1 U22.6(OUT)
N$91: R92.1 S20.2(WIPER)
N$92: R92.2 U22.2(IN-)
N$93: R94.2 U22.3(IN+)
N$94: R93.1 U21.6(OUT)
N$95: R96.1 U21.8(SHDN)
Unconnected: U21.1(NC_2) U21.5(NC) U22.1(NC_2) U22.5(NC)

## Sheet 12 of 17
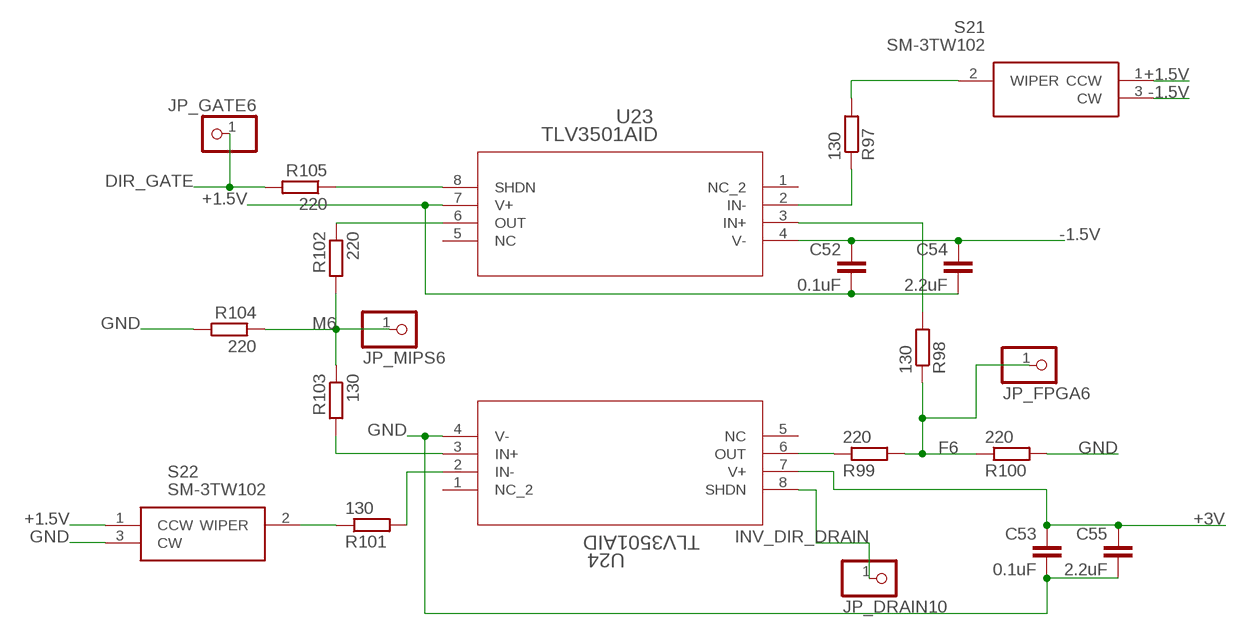
[diagram p11: schematic, sheet 12]

### Parts
C52  0.1uF  C-EUC0805  [C0805]
C53  0.1uF  C-EUC0805  [C0805]
C54  2.2uF  C-EUC0805  [C0805]
C55  2.2uF  C-EUC0805  [C0805]
JP_DRAIN10  PINHD-1X1  [1X01]
JP_FPGA6  PINHD-1X1  [1X01]
JP_GATE6  PINHD-1X1  [1X01]
JP_MIPS6  PINHD-1X1  [1X01]
R97  130  R-EU_R0805  [R0805]
R98  130  R-EU_R0603  [R0603]
R99  220  R-EU_R0805  [R0805]
R100  220  R-EU_R0805  [R0805]
R101  130  R-EU_R0805  [R0805]
R102  220  R-EU_R0805  [R0805]
R103  130  R-EU_R0805  [R0805]
R104  220  R-EU_R0805  [R0805]
R105  220  R-EU_R0805  [R0805]
S21  SM-3TW102  [SM3TW102]
S22  SM-3TW102  [SM3TW102]
U23  TLV3501AID  [D8]
U24  TLV3501AID  [D8]

### Nets
+1.5V: C52.2 C54.2 S21.1(CCW) S22.1(CCW) U23.7(V+) ; also sheet 1,2,3,4,5,6,7,8,9,10,11,13,14,15,16,17
+3V: C53.1 C55.1 U24.7(V+) ; also sheet 1,2,3,4,5,6,7,8,9,10,11,13,14,15,16,17
-1.5V: C52.1 C54.1 S21.3(CW) U23.4(V-) ; also sheet 1,2,3,4,5,6,7,8,9,10,11,13,14,15,16,17
DIR_GATE: JP_GATE6.1 R105.2 ; also sheet 1,2,3,4,5,6,7,8,9,10,11,13,14,15,16,17
F6: JP_FPGA6.1 R98.1 R99.2 R100.1 ; also sheet 1
GND: C53.2 C55.2 R100.2 R104.2 S22.3(CW) U24.4(V-) ; also sheet 1,2,3,4,5,6,7,8,9,10,11,13,14,15,16,17
INV_DIR_DRAIN: JP_DRAIN10.1 U24.8(SHDN) ; also sheet 1,2,3,4,5,6,7,8,9,10,11,13,14,15,16,17
M6: JP_MIPS6.1 R102.2 R103.1 R104.1 ; also sheet 1
N$96: R97.2 S21.2(WIPER)
N$97: R97.1 U23.2(IN-)
N$98: R98.2 U23.3(IN+)
N$99: R99.1 U24.6(OUT)
N$100: R101.1 S22.2(WIPER)
N$101: R101.2 U24.2(IN-)
N$102: R103.2 U24.3(IN+)
N$103: R102.1 U23.6(OUT)
N$104: R105.1 U23.8(SHDN)
Unconnected: U23.1(NC_2) U23.5(NC) U24.1(NC_2) U24.5(NC)

## Sheet 13 of 17
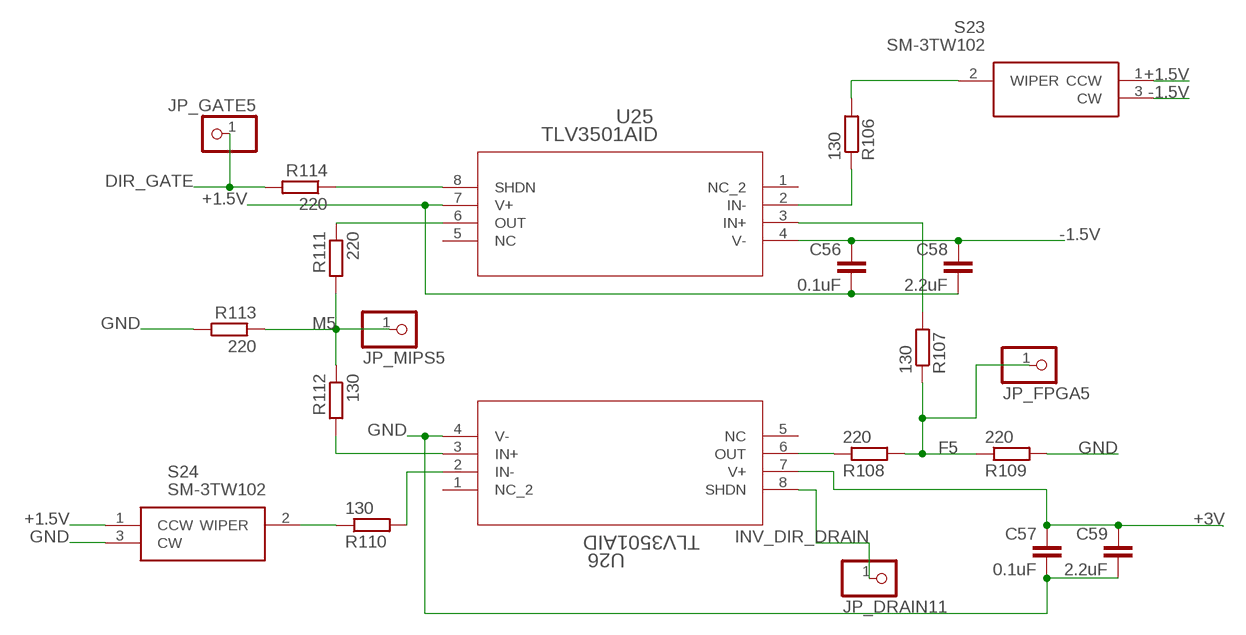
[diagram p12: schematic, sheet 13]

### Parts
C56  0.1uF  C-EUC0805  [C0805]
C57  0.1uF  C-EUC0805  [C0805]
C58  2.2uF  C-EUC0805  [C0805]
C59  2.2uF  C-EUC0805  [C0805]
JP_DRAIN11  PINHD-1X1  [1X01]
JP_FPGA5  PINHD-1X1  [1X01]
JP_GATE5  PINHD-1X1  [1X01]
JP_MIPS5  PINHD-1X1  [1X01]
R106  130  R-EU_R0805  [R0805]
R107  130  R-EU_R0603  [R0603]
R108  220  R-EU_R0805  [R0805]
R109  220  R-EU_R0805  [R0805]
R110  130  R-EU_R0805  [R0805]
R111  220  R-EU_R0805  [R0805]
R112  130  R-EU_R0805  [R0805]
R113  220  R-EU_R0805  [R0805]
R114  220  R-EU_R0805  [R0805]
S23  SM-3TW102  [SM3TW102]
S24  SM-3TW102  [SM3TW102]
U25  TLV3501AID  [D8]
U26  TLV3501AID  [D8]

### Nets
+1.5V: C56.2 C58.2 S23.1(CCW) S24.1(CCW) U25.7(V+) ; also sheet 1,2,3,4,5,6,7,8,9,10,11,12,14,15,16,17
+3V: C57.1 C59.1 U26.7(V+) ; also sheet 1,2,3,4,5,6,7,8,9,10,11,12,14,15,16,17
-1.5V: C56.1 C58.1 S23.3(CW) U25.4(V-) ; also sheet 1,2,3,4,5,6,7,8,9,10,11,12,14,15,16,17
DIR_GATE: JP_GATE5.1 R114.2 ; also sheet 1,2,3,4,5,6,7,8,9,10,11,12,14,15,16,17
F5: JP_FPGA5.1 R107.1 R108.2 R109.1 ; also sheet 1
GND: C57.2 C59.2 R109.2 R113.2 S24.3(CW) U26.4(V-) ; also sheet 1,2,3,4,5,6,7,8,9,10,11,12,14,15,16,17
INV_DIR_DRAIN: JP_DRAIN11.1 U26.8(SHDN) ; also sheet 1,2,3,4,5,6,7,8,9,10,11,12,14,15,16,17
M5: JP_MIPS5.1 R111.2 R112.1 R113.1 ; also sheet 1
N$105: R106.2 S23.2(WIPER)
N$106: R106.1 U25.2(IN-)
N$107: R107.2 U25.3(IN+)
N$108: R108.1 U26.6(OUT)
N$109: R110.1 S24.2(WIPER)
N$110: R110.2 U26.2(IN-)
N$111: R112.2 U26.3(IN+)
N$112: R111.1 U25.6(OUT)
N$113: R114.1 U25.8(SHDN)
Unconnected: U25.1(NC_2) U25.5(NC) U26.1(NC_2) U26.5(NC)

## Sheet 14 of 17
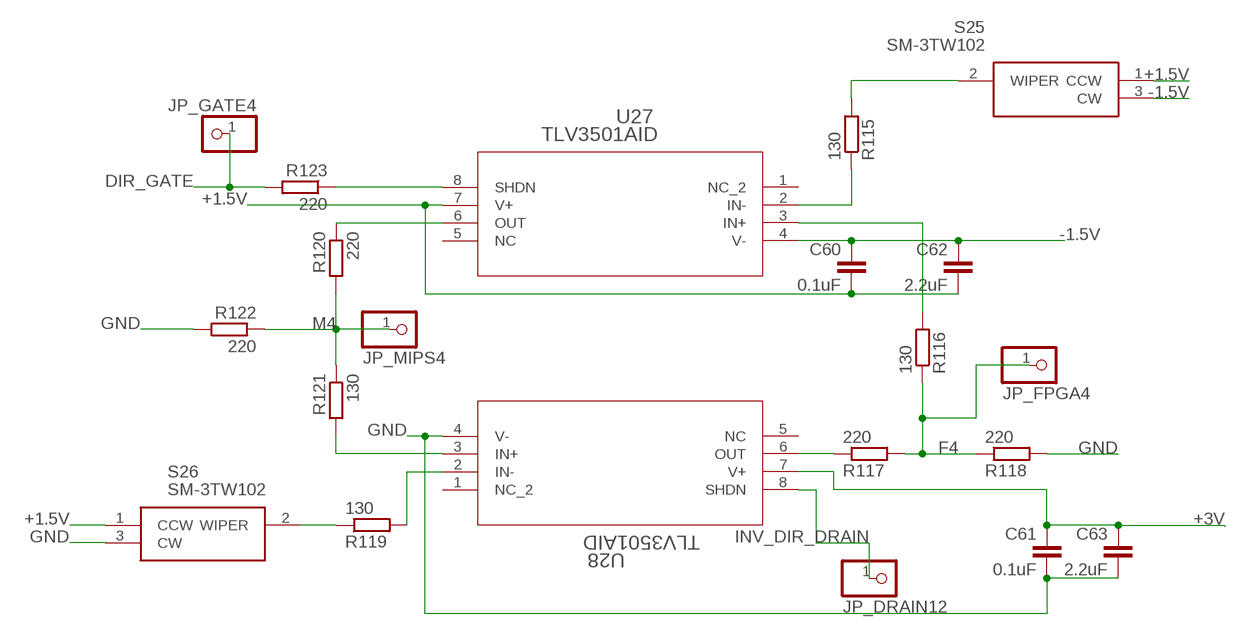
[diagram p13: schematic, sheet 14]

### Parts
C60  0.1uF  C-EUC0805  [C0805]
C61  0.1uF  C-EUC0805  [C0805]
C62  2.2uF  C-EUC0805  [C0805]
C63  2.2uF  C-EUC0805  [C0805]
JP_DRAIN12  PINHD-1X1  [1X01]
JP_FPGA4  PINHD-1X1  [1X01]
JP_GATE4  PINHD-1X1  [1X01]
JP_MIPS4  PINHD-1X1  [1X01]
R115  130  R-EU_R0805  [R0805]
R116  130  R-EU_R0603  [R0603]
R117  220  R-EU_R0805  [R0805]
R118  220  R-EU_R0805  [R0805]
R119  130  R-EU_R0805  [R0805]
R120  220  R-EU_R0805  [R0805]
R121  130  R-EU_R0805  [R0805]
R122  220  R-EU_R0805  [R0805]
R123  220  R-EU_R0805  [R0805]
S25  SM-3TW102  [SM3TW102]
S26  SM-3TW102  [SM3TW102]
U27  TLV3501AID  [D8]
U28  TLV3501AID  [D8]

### Nets
+1.5V: C60.2 C62.2 S25.1(CCW) S26.1(CCW) U27.7(V+) ; also sheet 1,2,3,4,5,6,7,8,9,10,11,12,13,15,16,17
+3V: C61.1 C63.1 U28.7(V+) ; also sheet 1,2,3,4,5,6,7,8,9,10,11,12,13,15,16,17
-1.5V: C60.1 C62.1 S25.3(CW) U27.4(V-) ; also sheet 1,2,3,4,5,6,7,8,9,10,11,12,13,15,16,17
DIR_GATE: JP_GATE4.1 R123.2 ; also sheet 1,2,3,4,5,6,7,8,9,10,11,12,13,15,16,17
F4: JP_FPGA4.1 R116.1 R117.2 R118.1 ; also sheet 1
GND: C61.2 C63.2 R118.2 R122.2 S26.3(CW) U28.4(V-) ; also sheet 1,2,3,4,5,6,7,8,9,10,11,12,13,15,16,17
INV_DIR_DRAIN: JP_DRAIN12.1 U28.8(SHDN) ; also sheet 1,2,3,4,5,6,7,8,9,10,11,12,13,15,16,17
M4: JP_MIPS4.1 R120.2 R121.1 R122.1 ; also sheet 1
N$114: R115.2 S25.2(WIPER)
N$115: R115.1 U27.2(IN-)
N$116: R116.2 U27.3(IN+)
N$117: R117.1 U28.6(OUT)
N$118: R119.1 S26.2(WIPER)
N$119: R119.2 U28.2(IN-)
N$120: R121.2 U28.3(IN+)
N$121: R120.1 U27.6(OUT)
N$122: R123.1 U27.8(SHDN)
Unconnected: U27.1(NC_2) U27.5(NC) U28.1(NC_2) U28.5(NC)

## Sheet 15 of 17
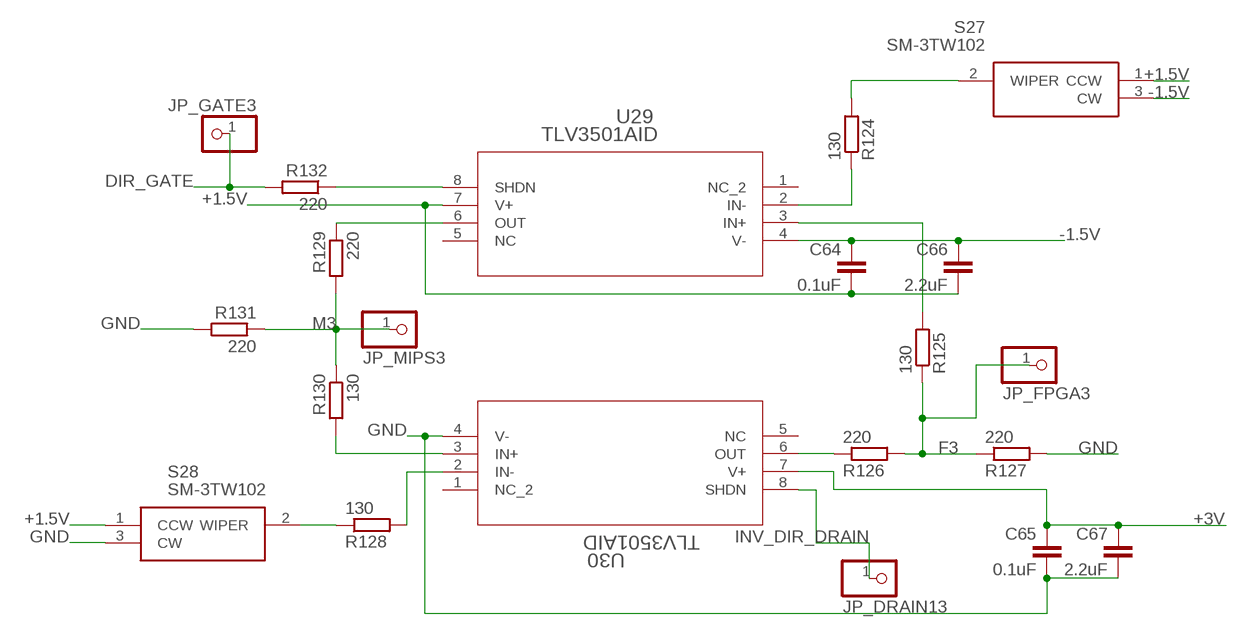
[diagram p14: schematic, sheet 15]

### Parts
C64  0.1uF  C-EUC0805  [C0805]
C65  0.1uF  C-EUC0805  [C0805]
C66  2.2uF  C-EUC0805  [C0805]
C67  2.2uF  C-EUC0805  [C0805]
JP_DRAIN13  PINHD-1X1  [1X01]
JP_FPGA3  PINHD-1X1  [1X01]
JP_GATE3  PINHD-1X1  [1X01]
JP_MIPS3  PINHD-1X1  [1X01]
R124  130  R-EU_R0805  [R0805]
R125  130  R-EU_R0603  [R0603]
R126  220  R-EU_R0805  [R0805]
R127  220  R-EU_R0805  [R0805]
R128  130  R-EU_R0805  [R0805]
R129  220  R-EU_R0805  [R0805]
R130  130  R-EU_R0805  [R0805]
R131  220  R-EU_R0805  [R0805]
R132  220  R-EU_R0805  [R0805]
S27  SM-3TW102  [SM3TW102]
S28  SM-3TW102  [SM3TW102]
U29  TLV3501AID  [D8]
U30  TLV3501AID  [D8]

### Nets
+1.5V: C64.2 C66.2 S27.1(CCW) S28.1(CCW) U29.7(V+) ; also sheet 1,2,3,4,5,6,7,8,9,10,11,12,13,14,16,17
+3V: C65.1 C67.1 U30.7(V+) ; also sheet 1,2,3,4,5,6,7,8,9,10,11,12,13,14,16,17
-1.5V: C64.1 C66.1 S27.3(CW) U29.4(V-) ; also sheet 1,2,3,4,5,6,7,8,9,10,11,12,13,14,16,17
DIR_GATE: JP_GATE3.1 R132.2 ; also sheet 1,2,3,4,5,6,7,8,9,10,11,12,13,14,16,17
F3: JP_FPGA3.1 R125.1 R126.2 R127.1 ; also sheet 1
GND: C65.2 C67.2 R127.2 R131.2 S28.3(CW) U30.4(V-) ; also sheet 1,2,3,4,5,6,7,8,9,10,11,12,13,14,16,17
INV_DIR_DRAIN: JP_DRAIN13.1 U30.8(SHDN) ; also sheet 1,2,3,4,5,6,7,8,9,10,11,12,13,14,16,17
M3: JP_MIPS3.1 R129.2 R130.1 R131.1 ; also sheet 1
N$123: R124.2 S27.2(WIPER)
N$124: R124.1 U29.2(IN-)
N$125: R125.2 U29.3(IN+)
N$126: R126.1 U30.6(OUT)
N$127: R128.1 S28.2(WIPER)
N$128: R128.2 U30.2(IN-)
N$129: R130.2 U30.3(IN+)
N$130: R129.1 U29.6(OUT)
N$131: R132.1 U29.8(SHDN)
Unconnected: U29.1(NC_2) U29.5(NC) U30.1(NC_2) U30.5(NC)

## Sheet 16 of 17
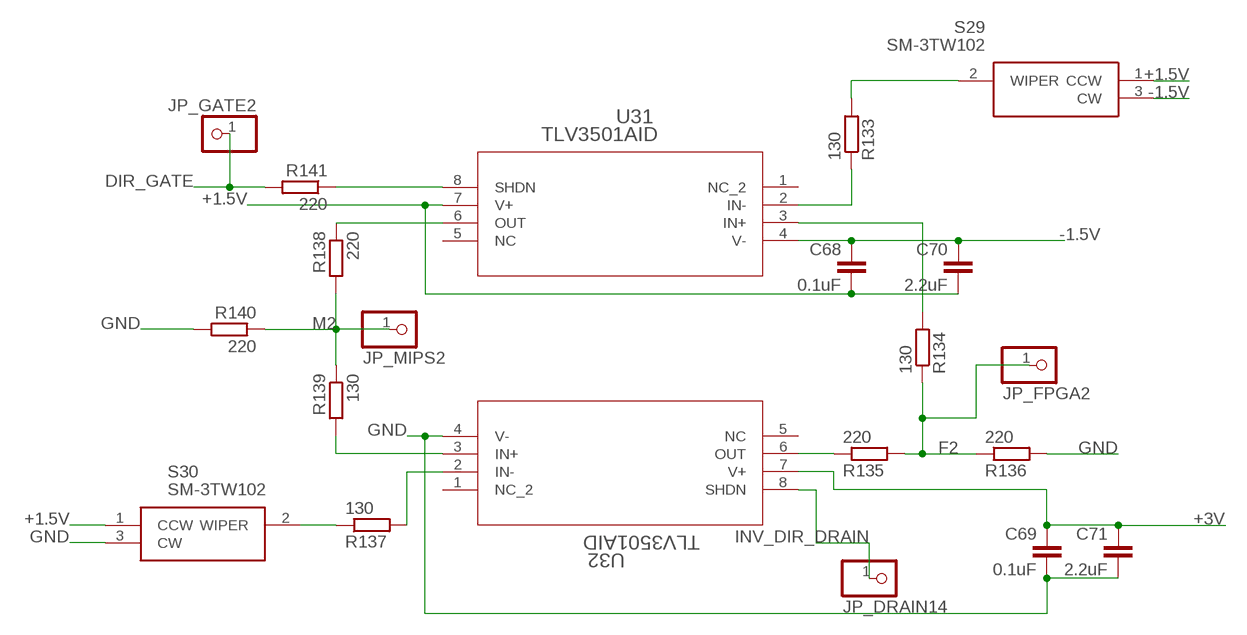
[diagram p15: schematic, sheet 16]

### Parts
C68  0.1uF  C-EUC0805  [C0805]
C69  0.1uF  C-EUC0805  [C0805]
C70  2.2uF  C-EUC0805  [C0805]
C71  2.2uF  C-EUC0805  [C0805]
JP_DRAIN14  PINHD-1X1  [1X01]
JP_FPGA2  PINHD-1X1  [1X01]
JP_GATE2  PINHD-1X1  [1X01]
JP_MIPS2  PINHD-1X1  [1X01]
R133  130  R-EU_R0805  [R0805]
R134  130  R-EU_R0603  [R0603]
R135  220  R-EU_R0805  [R0805]
R136  220  R-EU_R0805  [R0805]
R137  130  R-EU_R0805  [R0805]
R138  220  R-EU_R0805  [R0805]
R139  130  R-EU_R0805  [R0805]
R140  220  R-EU_R0805  [R0805]
R141  220  R-EU_R0805  [R0805]
S29  SM-3TW102  [SM3TW102]
S30  SM-3TW102  [SM3TW102]
U31  TLV3501AID  [D8]
U32  TLV3501AID  [D8]

### Nets
+1.5V: C68.2 C70.2 S29.1(CCW) S30.1(CCW) U31.7(V+) ; also sheet 1,2,3,4,5,6,7,8,9,10,11,12,13,14,15,17
+3V: C69.1 C71.1 U32.7(V+) ; also sheet 1,2,3,4,5,6,7,8,9,10,11,12,13,14,15,17
-1.5V: C68.1 C70.1 S29.3(CW) U31.4(V-) ; also sheet 1,2,3,4,5,6,7,8,9,10,11,12,13,14,15,17
DIR_GATE: JP_GATE2.1 R141.2 ; also sheet 1,2,3,4,5,6,7,8,9,10,11,12,13,14,15,17
F2: JP_FPGA2.1 R134.1 R135.2 R136.1 ; also sheet 1
GND: C69.2 C71.2 R136.2 R140.2 S30.3(CW) U32.4(V-) ; also sheet 1,2,3,4,5,6,7,8,9,10,11,12,13,14,15,17
INV_DIR_DRAIN: JP_DRAIN14.1 U32.8(SHDN) ; also sheet 1,2,3,4,5,6,7,8,9,10,11,12,13,14,15,17
M2: JP_MIPS2.1 R138.2 R139.1 R140.1 ; also sheet 1
N$132: R133.2 S29.2(WIPER)
N$133: R133.1 U31.2(IN-)
N$134: R134.2 U31.3(IN+)
N$135: R135.1 U32.6(OUT)
N$136: R137.1 S30.2(WIPER)
N$137: R137.2 U32.2(IN-)
N$138: R139.2 U32.3(IN+)
N$139: R138.1 U31.6(OUT)
N$140: R141.1 U31.8(SHDN)
Unconnected: U31.1(NC_2) U31.5(NC) U32.1(NC_2) U32.5(NC)

## Sheet 17 of 17
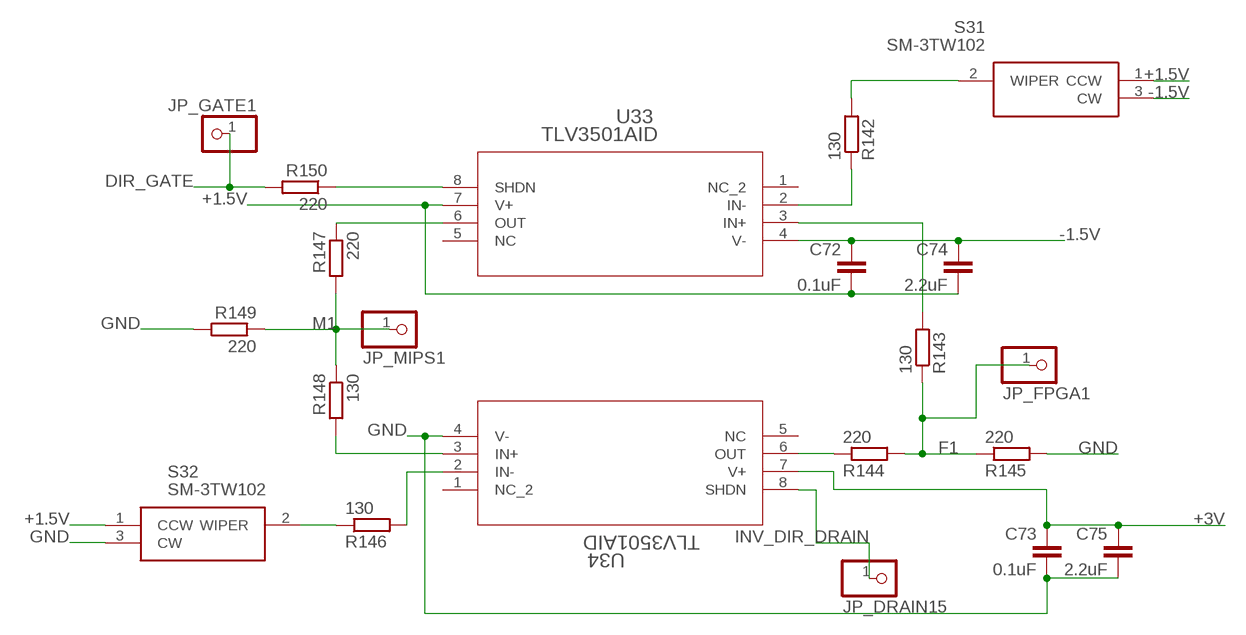
[diagram p16: schematic, sheet 17]

### Parts
C72  0.1uF  C-EUC0805  [C0805]
C73  0.1uF  C-EUC0805  [C0805]
C74  2.2uF  C-EUC0805  [C0805]
C75  2.2uF  C-EUC0805  [C0805]
JP_DRAIN15  PINHD-1X1  [1X01]
JP_FPGA1  PINHD-1X1  [1X01]
JP_GATE1  PINHD-1X1  [1X01]
JP_MIPS1  PINHD-1X1  [1X01]
R142  130  R-EU_R0805  [R0805]
R143  130  R-EU_R0603  [R0603]
R144  220  R-EU_R0805  [R0805]
R145  220  R-EU_R0805  [R0805]
R146  130  R-EU_R0805  [R0805]
R147  220  R-EU_R0805  [R0805]
R148  130  R-EU_R0805  [R0805]
R149  220  R-EU_R0805  [R0805]
R150  220  R-EU_R0805  [R0805]
S31  SM-3TW102  [SM3TW102]
S32  SM-3TW102  [SM3TW102]
U33  TLV3501AID  [D8]
U34  TLV3501AID  [D8]

### Nets
+1.5V: C72.2 C74.2 S31.1(CCW) S32.1(CCW) U33.7(V+) ; also sheet 1,2,3,4,5,6,7,8,9,10,11,12,13,14,15,16
+3V: C73.1 C75.1 U34.7(V+) ; also sheet 1,2,3,4,5,6,7,8,9,10,11,12,13,14,15,16
-1.5V: C72.1 C74.1 S31.3(CW) U33.4(V-) ; also sheet 1,2,3,4,5,6,7,8,9,10,11,12,13,14,15,16
DIR_GATE: JP_GATE1.1 R150.2 ; also sheet 1,2,3,4,5,6,7,8,9,10,11,12,13,14,15,16
F1: JP_FPGA1.1 R143.1 R144.2 R145.1 ; also sheet 1
GND: C73.2 C75.2 R145.2 R149.2 S32.3(CW) U34.4(V-) ; also sheet 1,2,3,4,5,6,7,8,9,10,11,12,13,14,15,16
INV_DIR_DRAIN: JP_DRAIN15.1 U34.8(SHDN) ; also sheet 1,2,3,4,5,6,7,8,9,10,11,12,13,14,15,16
M1: JP_MIPS1.1 R147.2 R148.1 R149.1 ; also sheet 1
N$141: R142.2 S31.2(WIPER)
N$142: R142.1 U33.2(IN-)
N$143: R143.2 U33.3(IN+)
N$144: R144.1 U34.6(OUT)
N$145: R146.1 S32.2(WIPER)
N$146: R146.2 U34.2(IN-)
N$147: R148.2 U34.3(IN+)
N$148: R147.1 U33.6(OUT)
N$149: R150.1 U33.8(SHDN)
Unconnected: U33.1(NC_2) U33.5(NC) U34.1(NC_2) U34.5(NC)

## Library data of the parts
+1.5V_TP1 +1.5V_TP2 +3V_TP1 +3V_TP2 +V_IN1 -1.5V_TP1 -1.5V_TP2 -V_IN1 DRAIN_TP1 EN_TP1 F17_TP1 GATE_TP1 JP_DRAIN JP_DRAIN1-JP_DRAIN15 JP_FPGA1-JP_FPGA14 JP_FPGA16 JP_FPGAP15 JP_GATE1-JP_GATE14 JP_GATE16 JP_GATEP15 JP_MIPS1-JP_MIPS16 M17_TP1 POW3 POW4 = pinhead:PINHD-1X1: PIN HEADER
C1-C3 C6-C10 C13-C15 C19-C75 C82-C87 = rcl:C-EU: CAPACITOR, European symbol; SPICEPREFIX: C
C4 C5 C11 C12 C16-C18 = resistor:CPOL-US: POLARIZED CAPACITOR, American symbol
D3 D4 D7 D8 = diode:1N4004: DIODE general purpose rectifier, 1 A
IC3 IC4 = LM317AMDT_NOPB:LM317AMDT_NOPB: 1% Accurate, 1.5A Adjustable Linear Regulator with Short Circuit Protection Source: Datasheet <http://www.ti.com/lit/ds/symlink/lm317-n.pdf>; DESCRIPTION: 1% Accurate, 1.5A Adjustable Linear Regulator with Short Circuit Protection; HEIGHT: 2.38mm; MANUFACTURER_NAME: Texas Instruments; MANUFACTURER_PART_NUMBER: LM317AMDT/NOPB; MOUSER_PART_NUMBER: 926-LM317AMDT/NOPB; MOUSER_PRICE-STOCK: https://www.mouser.co.uk/ProductDetail/Texas-Instruments/LM317AMDT-NOPB?qs=X1J7HmVL2ZHvM%2FHpkMbGJg%3D%3D
J1 J2 = 5022442430:5022442430: MOLEX - 5022442430 - 0.5 FFC FOR LVDS ASSY 24CKT EMBSTP PKG Source: Datasheet <https://www.arrow.com/en/products/502244-2430/molex>; ARROW_PART_NUMBER: 5022442430; ARROW_PRICE-STOCK: https://www.arrow.com/en/products/502244-2430/molex; DESCRIPTION: MOLEX - 5022442430 - 0.5 FFC FOR LVDS ASSY 24CKT EMBSTP PKG; HEIGHT: 2.33mm; MANUFACTURER_NAME: Molex; MANUFACTURER_PART_NUMBER: 5022442430
J5 J6 = 70287-1098:70287-1098: Headers & Wire Housings CGrid Bkwy Hdr DR Rt DR RtPn 15''SAu 4Ckt Source: Datasheet <https://www.molex.com/pdm_docs/sd/702871098_sd.pdf>; DESCRIPTION: Headers & Wire Housings CGrid Bkwy Hdr DR Rt DR RtPn 15''SAu 4Ckt; HEIGHT: 8.51mm; MANUFACTURER_NAME: Molex; MANUFACTURER_PART_NUMBER: 70287-1098; MOUSER_PART_NUMBER: 538-70287-1098; MOUSER_PRICE-STOCK: https://www.mouser.co.uk/ProductDetail/Molex/70287-1098?qs=kYQSPAH4sJyJ%2F7vCw3ffjg%3D%3D
R2 R9-R12 R151 = resistor:R-US_: RESISTOR, American symbol
R3-R8 R13-R150 R159-R166 = rcl:R-EU_: RESISTOR, European symbol; SPICEPREFIX: R
S1-S32 = SM-3TW102:SM-3TW102: Trimmer Resistors - SMD 1 KW 3mm SMD multi turn J-lead, top adj., 11 turn Source: Datasheet <https://www.mouser.it/ProductDetail/Nidec-Copal/SM-3TW102/?qs=XeJtXLiO41QfszlUsJazpw==>; DESCRIPTION: Trimmer Resistors - SMD 1 KW 3mm SMD multi turn J-lead, top adj., 11 turn; HEIGHT: 4.5mm; MANUFACTURER_NAME: NIDEC COPAL; MANUFACTURER_PART_NUMBER: SM-3TW102; MOUSER_PART_NUMBER: 229-SM-3TW102; MOUSER_PRICE-STOCK: https://www.mouser.co.uk/ProductDetail/Nidec-Copal/SM-3TW102?qs=XeJtXLiO41QfszlUsJazpw%3D%3D
U1 = DF10S:DF10S: Bridge Rectifiers; DESCRIPTION: Bridge Rectifier Single Phase Standard 1 kV Surface Mount 4-SDIP; DIGI-KEY_PART_NUMBER: DF10STR-ND; MF: ON; MP: DF10S; PACKAGE: SMD-4 ON; PURCHASE-URL: https://pricing.snapeda.com/search/part/DF10S/?ref=eda
U2 = _hhn_78xx_79xx_NCV78xx_d2pak_dpak:MC79*: 79xx SMD (D2PAK) (MC)79xx..D2T (D2PAK-3; Rth,JA = 45 K/W @ 10x10mm copper area) Linear Voltage Regulators, Negative, 1 A (ON Semiconductor) Package dimenisions and soldering footprints acc. to ONSEMI specs. Source: http://onsemi.com Datasheet document#: MC7900/D Technologies: 79xxyD2Tz: xx = Output Voltage (V) y, z: additional suffixes see manufacturer's datasheet Author: Dipl.-Ing. FH Rainer Bayer HHN Hochschule Heilbronn, rainer.bayer@hs-heilbronn.de Ingenieurbüro ing-rb, mail@ing-rb.de
U3-U34 U39 U40 = TLV3501:TLV3501AID; COPYRIGHT: Copyright (C) 2022 Ultra Librarian. All rights reserved.; DIGI-KEY_PART_NUMBER_1: 296-17921-5-ND; DIGI-KEY_PART_NUMBER_2: 2156-TLV3501AID-ND; MANUFACTURER_PART_NUMBER: TLV3501AID; MFR_NAME: Texas Instruments
U38 = CPH3355:CPH3355-TL-W; COPYRIGHT: Copyright (C) 2022 Ultra Librarian. All rights reserved.; DIGI-KEY_PART_NUMBER_1: CPH3355-TL-WOSTR-ND; DIGI-KEY_PART_NUMBER_2: CPH3355-TL-WOSCT-ND; DIGI-KEY_PART_NUMBER_3: CPH3355-TL-WOSDKR-ND; MANUFACTURER_PART_NUMBER: CPH3355-TL-W; MFR_NAME: onsemi
X2 = con-molex:22-23-2041: .100" (2.54mm) Center Header - 4 Pin; MF: MOLEX; MPN: 22-23-2041; OC_FARNELL: 1462920; OC_NEWARK: 38C0355